# EasyEDA Pro project 14届国（未完成）.epro

# Schematic SCH

## Sheets
1 POWER: Create Date: 2024-05-15; Page Name: POWER; Project Name: lq14; Schematic Name: SCH; Update Date: 2024-05-15
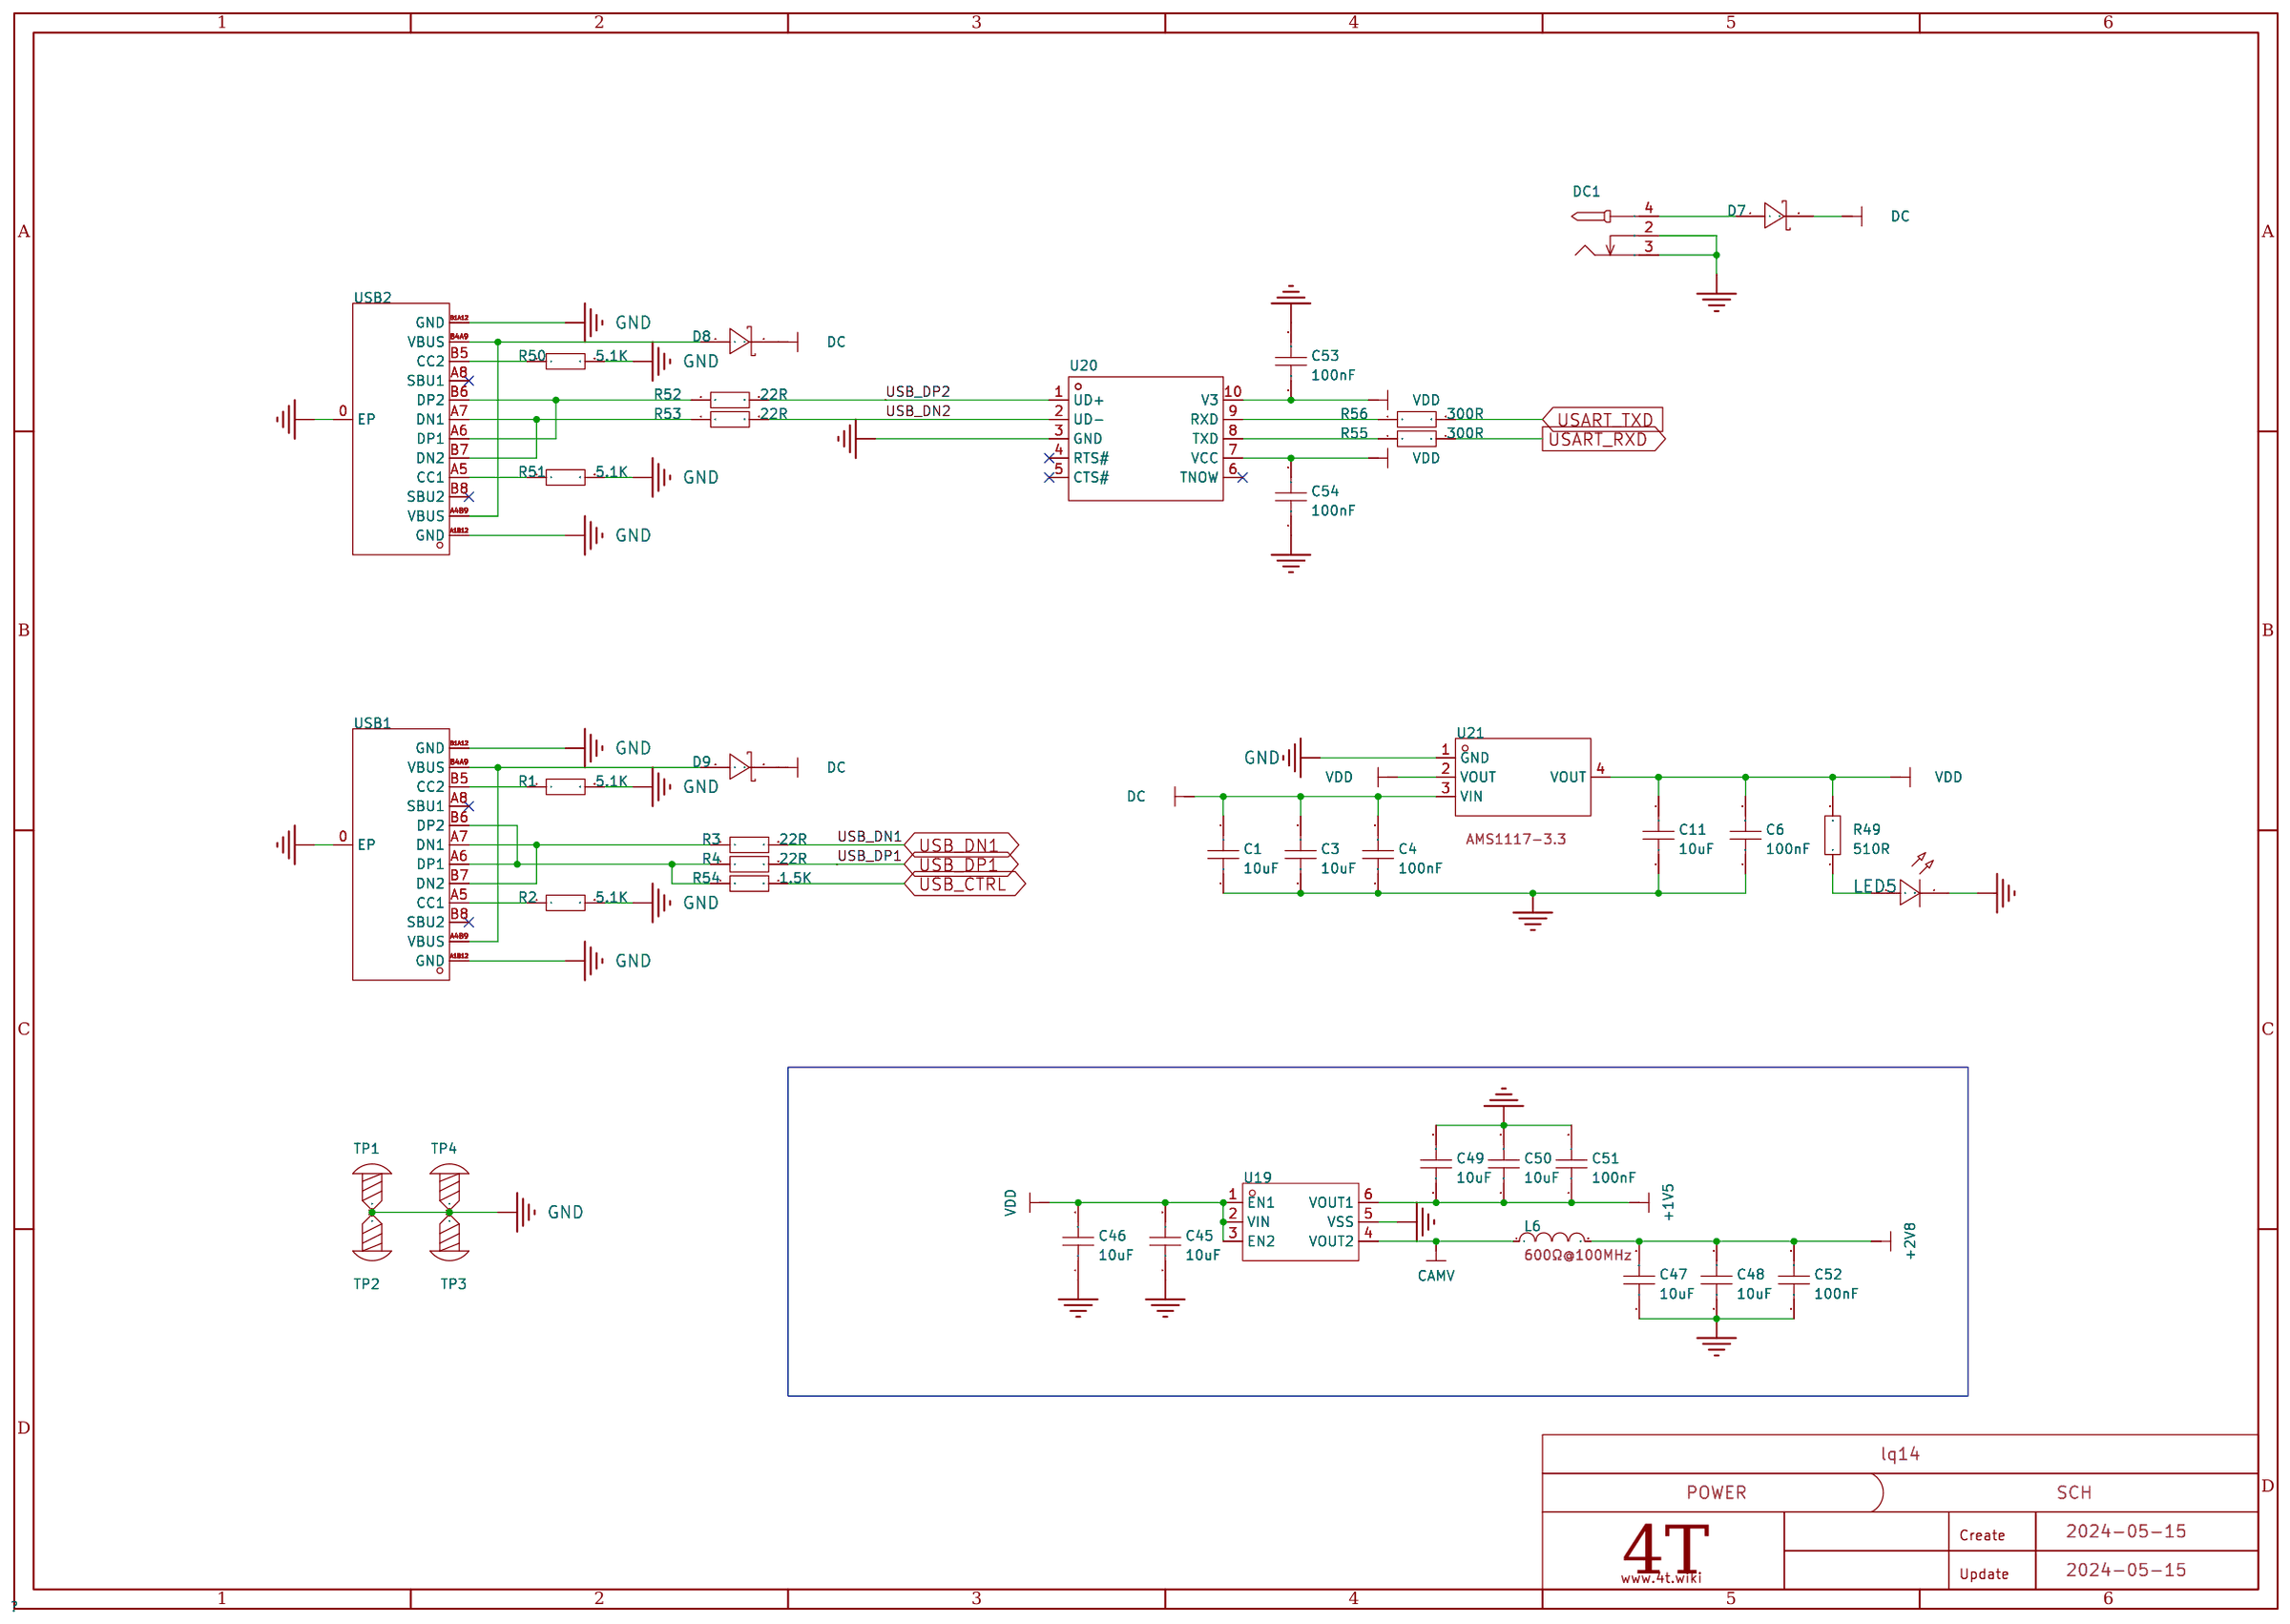
[diagram p0: POWER]
2 RELAY: Page Name: RELAY
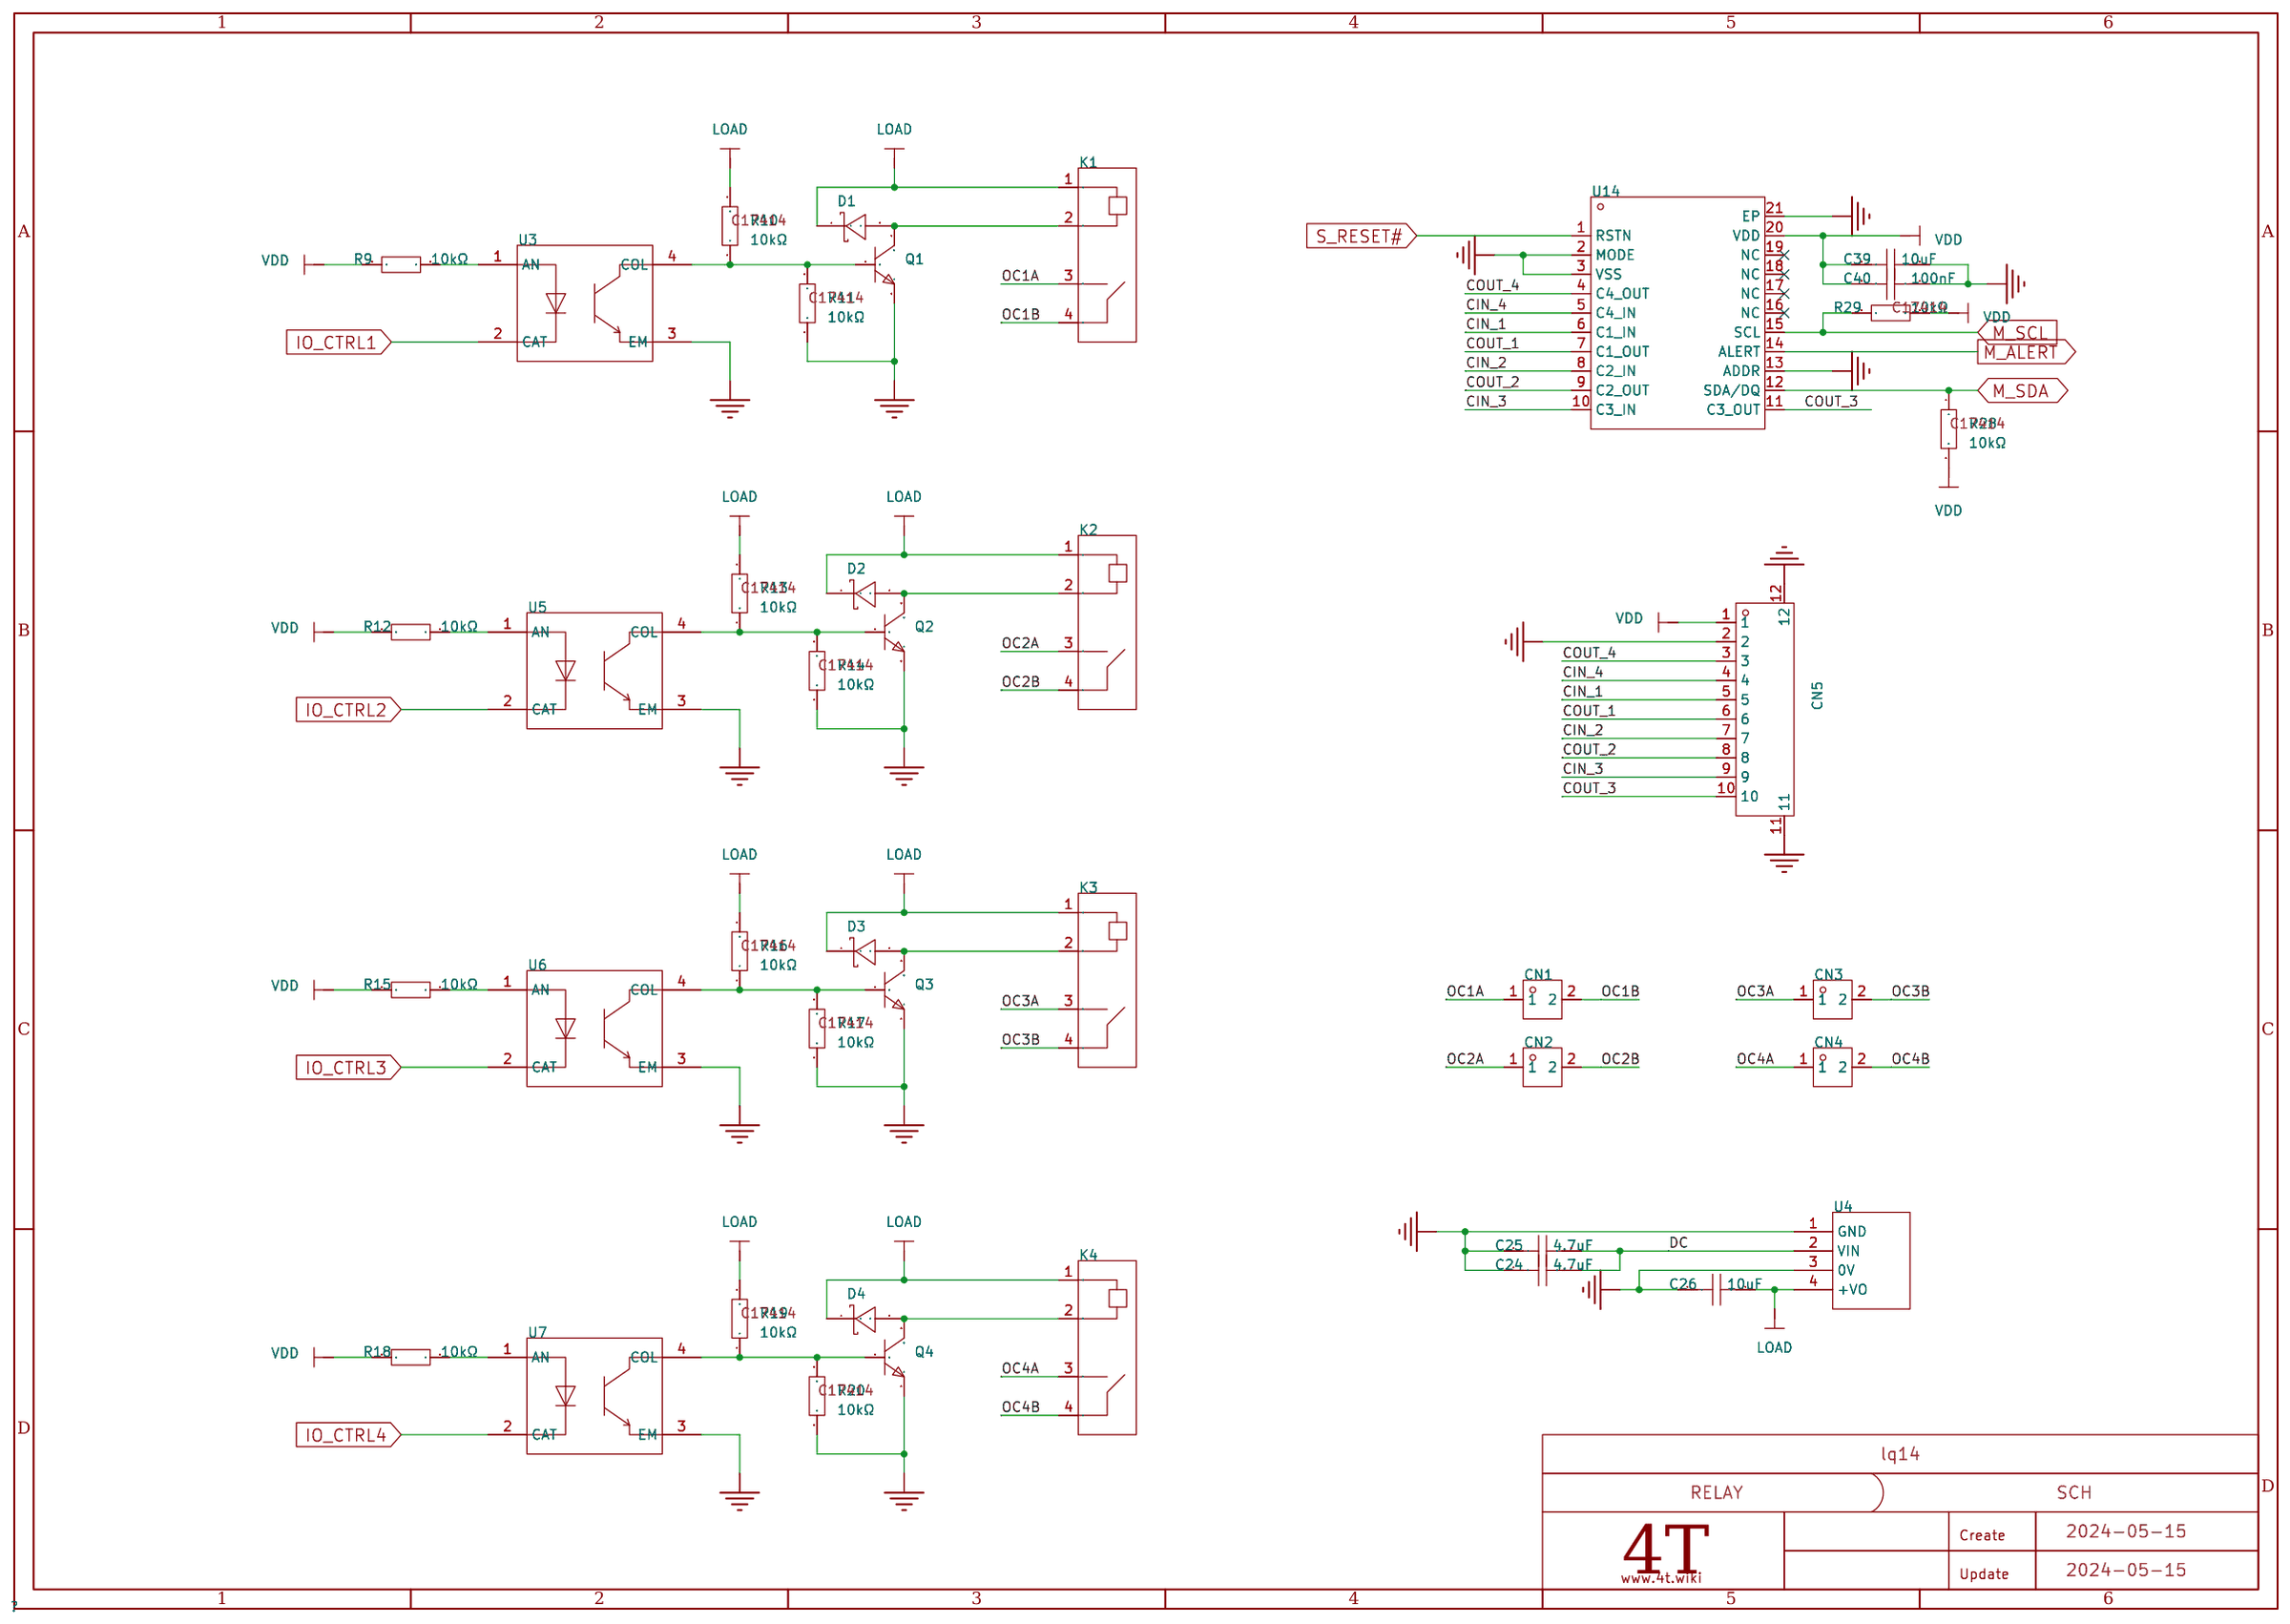
[diagram p1: RELAY]
3 MCU: Page Name: MCU
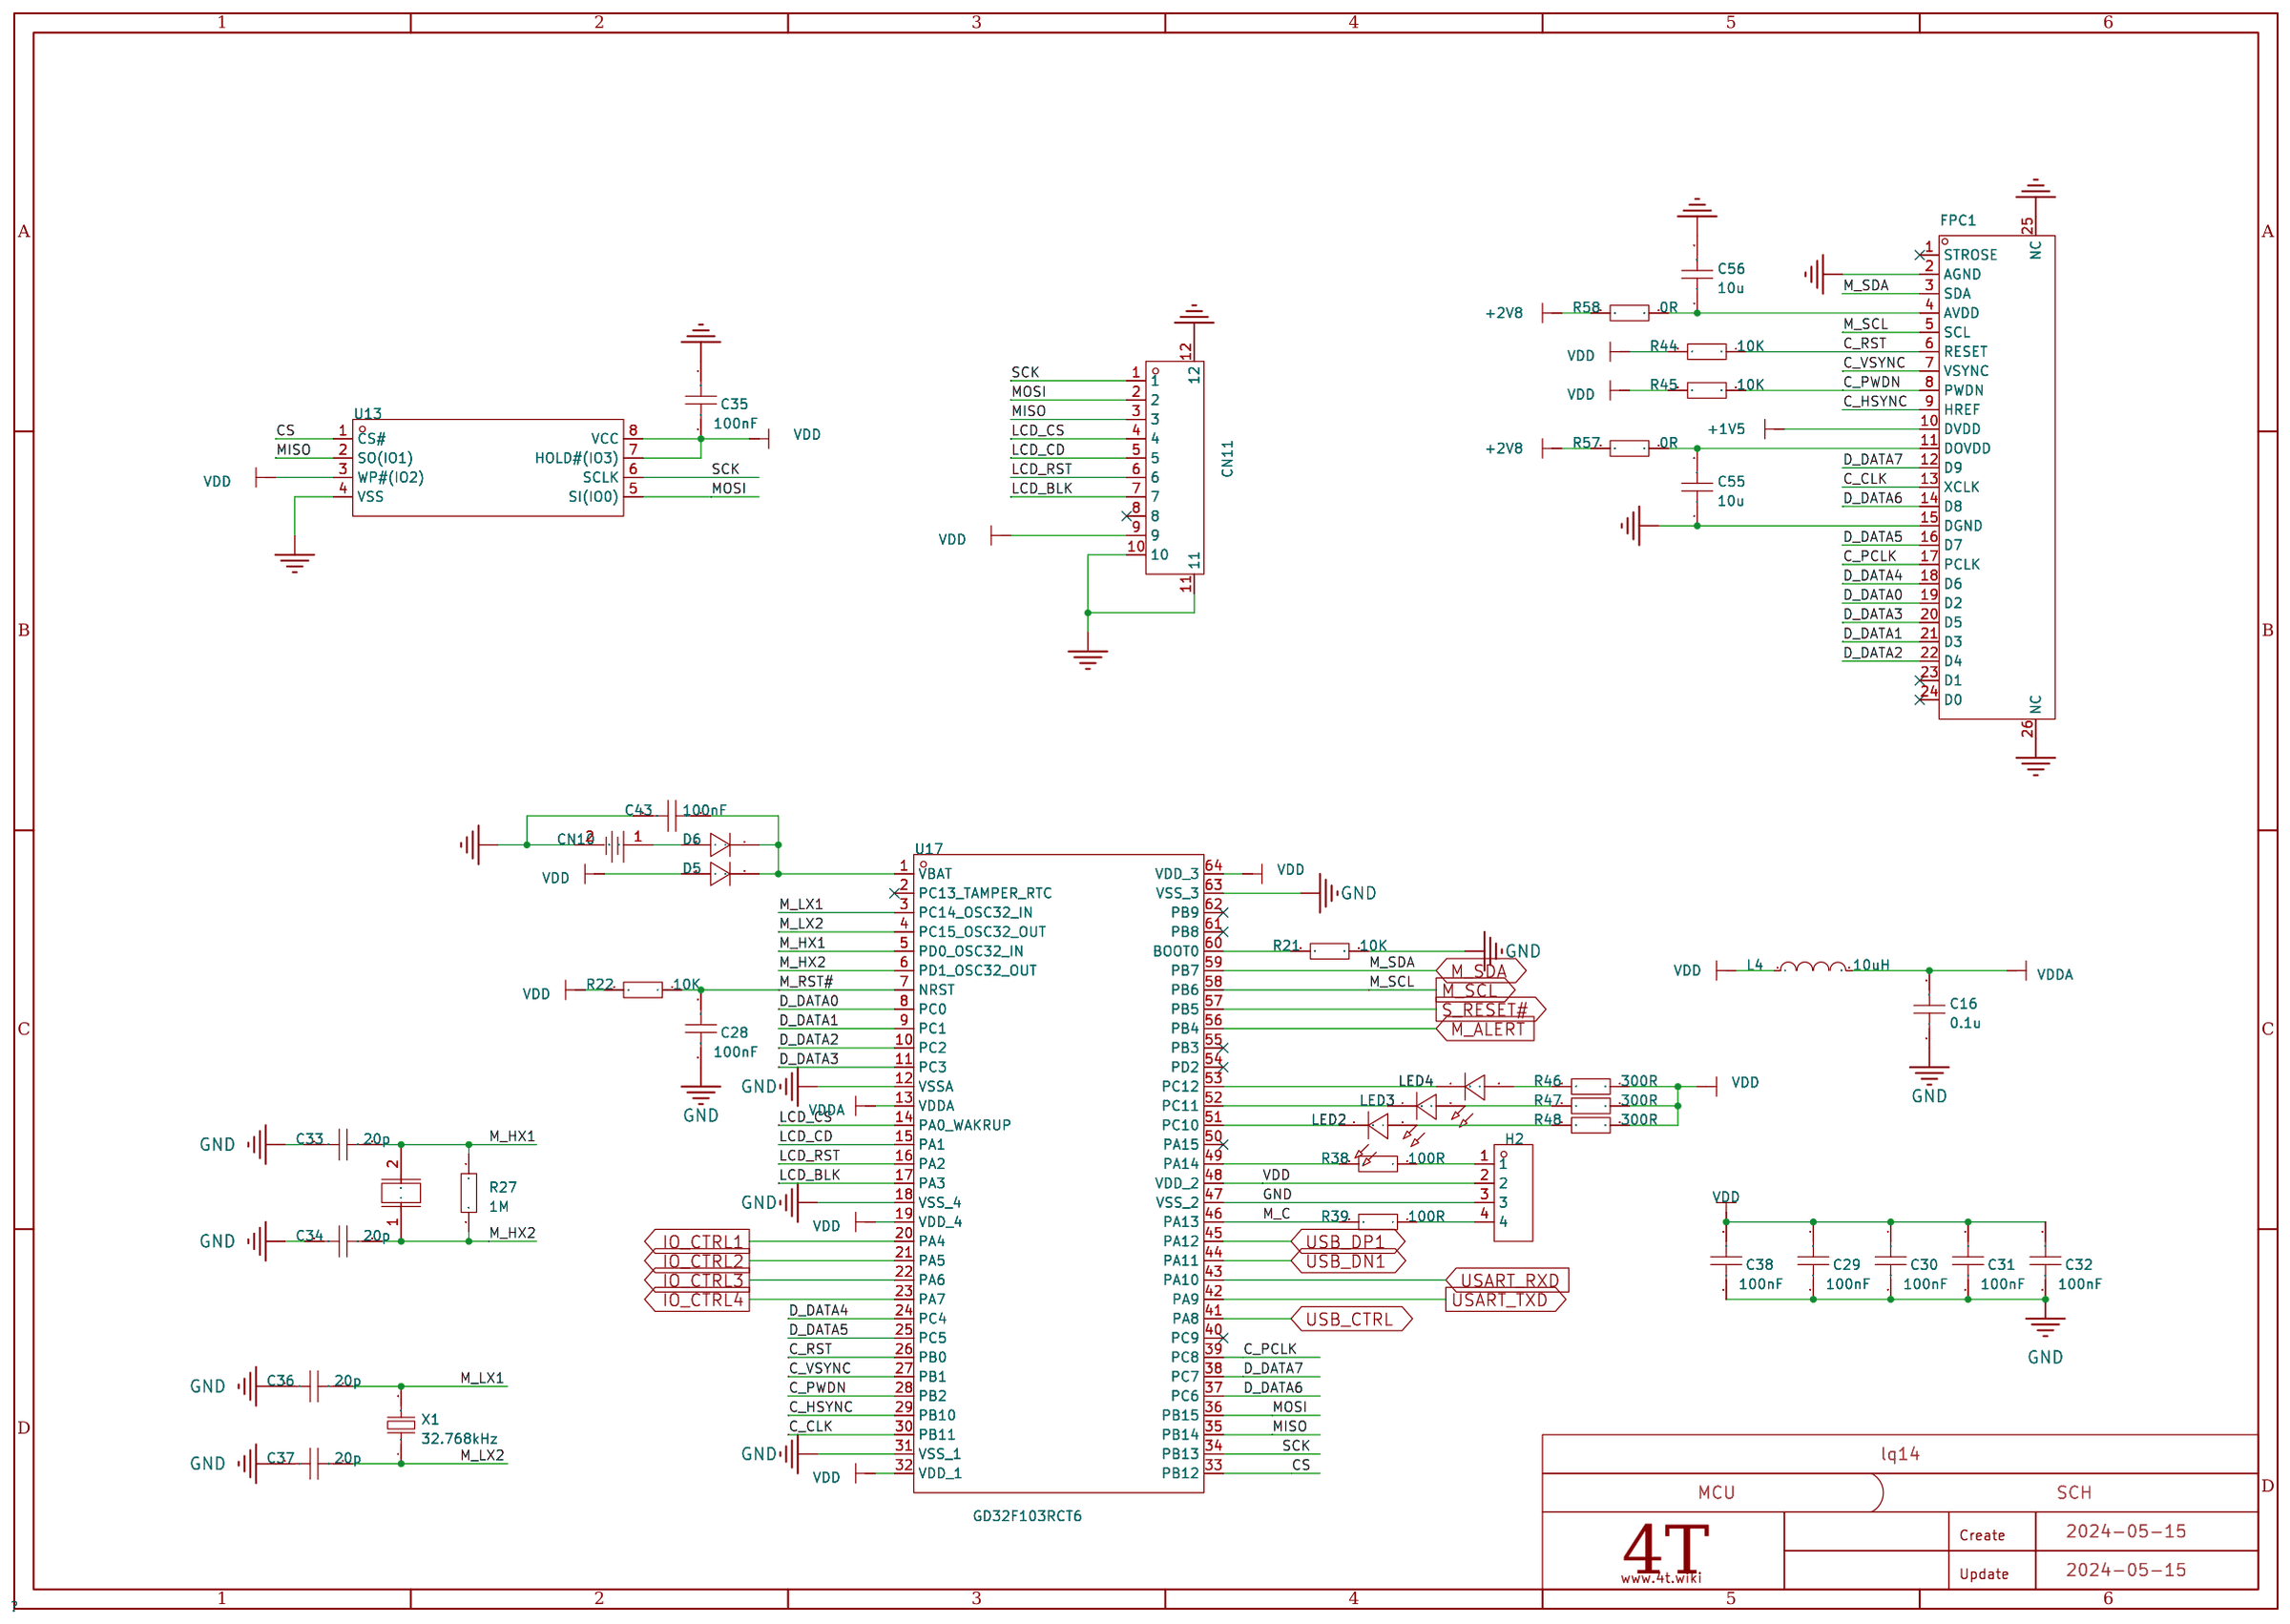
[diagram p2: MCU]

## Parts
sheet MCU
C16  0.1u  [C0805]
C28  100nF  [C0805]
C29  100nF  [C0805]
C30  100nF  [C0805]
C31  100nF  [C0805]
C32  100nF  [C0805]
C33  20p  [C0805]
C34  20p  [C0805]
C35  100nF  [C0805]
C36  20p  [C0805]
C37  20p  [C0805]
C38  100nF  [C0805]
C43  100nF  [C0805]
C55  10u  [C0805]
C56  10u  [C0805]
CN10  CR1220_B  [BAT-SMD_CR1220-2ZX]
CN11  KH-A1251WF-10A  [CONN_SMD_10P-P1.25_KINGHELM_KH-A1251WF-10A]
D5  1N4148WS  [SOD-323_L1.8-W1.3-LS2.5-RD]
D6  1N4148WS  [SOD-323_L1.8-W1.3-LS2.5-RD]
FPC1  F-FPC0M24P-C310  [FPC-SMD_P0.50-24P_XJ-FGS]
H2  2.54-1*4P母  [HDR-TH_4P-P2.54-V-F]
L4  10uH  [L0805]
LED2  -  [LED_0805]
LED3  -  [LED_0805]
LED4  -  [LED_0805]
R21  10K  [R0805]
R22  10K  [R0805]
R27  1M  [R0805]
R38  100R  [R0805]
R39  100R  [R0805]
R44  10K  [R0805]
R45  10K  [R0805]
R46  300R  [R0805]
R47  300R  [R0805]
R48  300R  [R0805]
R57  0R  [R0805]
R58  0R  [R0805]
U12  8M-5032-2P  [CRYSTAL-SMD_L5.0-W3.2]
U13  GD25Q16CSAG-SOP8_208MIL  [SOP-8_L5.2-W5.3-P1.27-LS7.9-BL]
U17  GD32F103RCT6  [LQFP-64_L10.0-W10.0-P0.50-LS12.0-BL]
X1  32.768kHz  [FC-135R_L3.2-W1.5]
sheet POWER
C1  10uF  [C0805]
C3  10uF  [C0805]
C4  100nF  [C0805]
C6  100nF  [C0805]
C11  10uF  [C0805]
C45  10uF  [C0805]
C46  10uF  [C0805]
C47  10uF  [C0805]
C48  10uF  [C0805]
C49  10uF  [C0805]
C50  10uF  [C0805]
C51  100nF  [C0805]
C52  100nF  [C0805]
C53  100nF  [C0805]
C54  100nF  [C0805]
D7  SS34  [SMA_L4.3-W2.6-LS5.0-RD]
D8  SS34  [SMA_L4.3-W2.6-LS5.0-RD]
D9  SS34  [SMA_L4.3-W2.6-LS5.0-RD]
DC1  -  [DC-2.0]
L6  BLM18AG601SN1D  [L0603]
LED5  -  [LED_0805]
R1  5.1K  [R0805]
R2  5.1K  [R0805]
R3  22R  [R0805]
R4  22R  [R0805]
R49  510R  [R0805]
R50  5.1K  [R0805]
R51  5.1K  [R0805]
R52  22R  [R0805]
R53  22R  [R0805]
R54  1.5K  [R0805]
R55  300R  [R0805]
R56  300R  [R0805]
TP1  -  [M3螺丝]
TP2  -  [M3螺丝]
TP3  -  [M3螺丝]
TP4  -  [M3螺丝]
U19  -  [SOT_DPV]
U20  CH340E  [MSOP-10_L3.0-W3.0-P0.50-LS5.0-BL]
U21  AMS1117-3.3  [SOT-223-3_L6.5-W3.4-P2.30-LS7.0-BR]
USB1  CQ-USB- TYPE-C 16P母座四脚插板有柱  [USB-C-SMD_CQ-USB-TYPE-C]
USB2  CQ-USB- TYPE-C 16P母座四脚插板有柱  [USB-C-SMD_CQ-USB-TYPE-C]
sheet RELAY
C24  4.7uF  [C0805]
C25  4.7uF  [C0805]
C26  10uF  [C0805]
C39  10uF  [C0805]
C40  100nF  [C0805]
CN1  KF128L-5.08-2P 蓝色  [TH_KF128L-5.08-2P]
CN2  KF128L-5.08-2P 蓝色  [TH_KF128L-5.08-2P]
CN3  KF128L-5.08-2P 蓝色  [TH_KF128L-5.08-2P]
CN4  KF128L-5.08-2P 蓝色  [TH_KF128L-5.08-2P]
CN5  KH-A1251WF-10A  [CONN_SMD_10P-P1.25_KINGHELM_KH-A1251WF-10A]
D1  SS14  [SMA_L4.2-W2.6-LS5.3-RD]
D2  SS14  [SMA_L4.2-W2.6-LS5.3-RD]
D3  SS14  [SMA_L4.2-W2.6-LS5.3-RD]
D4  SS14  [SMA_L4.2-W2.6-LS5.3-RD]
K1  HF49FD/012-1H12  [RELAY-TH_HF49FD-XXX-1H12-XXX]
K2  HF49FD/012-1H12  [RELAY-TH_HF49FD-XXX-1H12-XXX]
K3  HF49FD/012-1H12  [RELAY-TH_HF49FD-XXX-1H12-XXX]
K4  HF49FD/012-1H12  [RELAY-TH_HF49FD-XXX-1H12-XXX]
Q1  SS8050  [SOT-23-3_L2.9-W1.3-P1.90-LS2.4-BR]
Q2  SS8050  [SOT-23-3_L2.9-W1.3-P1.90-LS2.4-BR]
Q3  SS8050  [SOT-23-3_L2.9-W1.3-P1.90-LS2.4-BR]
Q4  SS8050  [SOT-23-3_L2.9-W1.3-P1.90-LS2.4-BR]
R9  10kΩ  [R0805]
R10  10kΩ  [R0805]
R11  10kΩ  [R0805]
R12  10kΩ  [R0805]
R13  10kΩ  [R0805]
R14  10kΩ  [R0805]
R15  10kΩ  [R0805]
R16  10kΩ  [R0805]
R17  10kΩ  [R0805]
R18  10kΩ  [R0805]
R19  10kΩ  [R0805]
R20  10kΩ  [R0805]
R28  10kΩ  [R0805]
R29  10kΩ  [R0805]
U3  TLP521-1XSM  [SMD-4_L4.6-W6.5-P2.54-LS10.2-BL]
U4  B0505S-1WR3  [PWRM-TH_B0503S-1WR3]
U5  TLP521-1XSM  [SMD-4_L4.6-W6.5-P2.54-LS10.2-BL]
U6  TLP521-1XSM  [SMD-4_L4.6-W6.5-P2.54-LS10.2-BL]
U7  TLP521-1XSM  [SMD-4_L4.6-W6.5-P2.54-LS10.2-BL]
U14  MDC04  [QFN-20_L3.0-W3.0-P0.40-BL-EP1.7]

## Library data of the parts
C1 C3 C4 C6 C11 C16 C45-C56 = CAP_0805: 容值:100nF;精度:±10%;额定电压:50V;温度系数:X7R;; Supplier Footprint: 0805
C28-C38 C43 = CAP_0603: Supplier Footprint: 0603
CN10 = CR1220_B: Supplier Part: C9900012049; Supplier Footprint: 1220; JLCPCB Part Class: 扩展库; Datasheet: https://atta.szlcsc.comnull; Supplier: LCSC
CN5 CN11 = KH-A1251WF-10A: 板载连接器MX1.25针座-10P 卧贴编带，匹配KH-A1250H-10P-JK; LCSC Part Name: 板载连接器; Supplier Part: C4943304; Manufacturer: kinghelm(金航标); Supplier Footprint: SMD,P=1.25mm; JLCPCB Part Class: Extended Part; Datasheet: https://atta.szlcsc.com/upload/public/pdf/source/20220712/B394C9B5DF1E4B9762CA63DDD21DD1B3.pdf; Supplier: LCSC
D5 D6 = 1N4148WS_C2128: 二极管配置:独立式;功率:200mW;直流反向耐压(Vr):100V;平均整流电流(Io):150mA;正向压降(Vf):1.25V@150mA;反向电流(Ir):1uA@75V;反向恢复时间(trr):4ns;工作温度:+150℃@(Tj);; LCSC Part Name: 100V 150mA 4ns T4; Supplier Part: C2128; Manufacturer: CJ(江苏长电/长晶); Supplier Footprint: SOD-323; JLCPCB Part Class: 基础库; Datasheet: https://atta.szlcsc.com/upload/public/pdf/source/20140809/1457707208178.pdf; Supplier: LCSC; Diode Configuration: 独立式; Power Dissipation: 200mW; Reverse Voltage (Vr): 100V; Average Rectified Current (Io): 150mA; Forward Voltage (Vf@If): 1.25V@150mA; Reverse Leakage Current: 1uA@75V; Reverse Recovery Time (trr): 4ns; Operating Temperature: +150℃@(Tj)
FPC1 = F-FPC0M24P-C310: 间距:0.5mm;触点数量:24;锁定特性:翻盖式;安装类型:卧贴;触点类型:下接;; LCSC Part Name: FPC插座 0.5mm间距 24P 翻盖式 下接; Supplier Part: C132514; Manufacturer: Ckmtw(灿科盟); Supplier Footprint: SMD,P=0.5mm; JLCPCB Part Class: Extended Part; Datasheet: https://atta.szlcsc.com/upload/public/pdf/source/20180105/C132514_15151572869031234524.pdf; Supplier: LCSC; Pitch: 0.5mm; Number of Contacts: 24; Locking Feature: 翻盖式; Mounting Type: 卧贴; Contact Type: 下接; Height Above Board: 2mm; FFC, FCB Thickness: 0.3mm~0.3mm; Pin Type: IN
H2 = 2.54-1*4P母: 排数:单排;总孔位数:4;间距:2.54mm;插孔结构:1x4P;行距:-;安装类型:直插;圆孔/方孔:方孔;额定电流:3A;额定电压:-;插孔方向:顶部;塑高:-;触头材质:青铜;触头镀层:-;工作温度范围:-40℃~+105℃;焊接温度(最大值):-;; LCSC Part Name: 2.54mm 1x4P; Supplier Part: C2718488; Manufacturer: BOOMELE(博穆精密); Supplier Footprint: 插件,P=2.54mm; JLCPCB Part Class: Extended Part; Datasheet: https://atta.szlcsc.com/upload/public/pdf/source/20210301/C2718488_F4427B881E42CAA8DDB0B1C12B3A522C.pdf; Supplier: LCSC; Number of Rows: 单排; Number of Holes: 4; Pitch: 2.54mm; Holes Structure: 1x4P; Mounting Type: 直插; Circular Hole / Square Hole: 方孔; Current Rating (Max): 3A; Holes Direction: 顶部; Contact Material: 青铜; Operating Temperature Range: -40℃~+105℃
L4 = L_0805: 电感值:10uH;精度:±10%;额定电流:15mA;饱和电流(Isat):-;直流电阻(DCR):1.15Ω;
LED2-LED4 = LED_0805-G: Supplier Footprint: 0805
R1-R4 R21 R22 R27 R38 R39 R44-R58 = Res_0805: Supplier Footprint: 0805
U12 = 8M-5032-2P: Supplier Part: C9900017580; Supplier Footprint: 8MHz; JLCPCB Part Class: 扩展库; Supplier: LCSC
U13 = GD25Q16CSAG-SOP8_208MIL: Supplier Part: C2891506; Supplier Footprint: SOP-8_L4.9-W3.9-P1.27-LS7.9; JLCPCB Part Class: 扩展库; Supplier: LCSC
U17 = GD32F103RCT6: CPU内核:ARM Cortex-M3;CPU最大主频:108MHz;程序存储容量:256KB;程序存储器类型:FLASH;RAM总容量:48KB;GPIO端口数量:51;; LCSC Part Name: ARM Cortex-M3 108MHz; Supplier Part: C80687; Manufacturer: GigaDevice(兆易创新); Supplier Footprint: LQFP-64(10x10); JLCPCB Part Class: 扩展库; Datasheet: https://atta.szlcsc.com/upload/public/pdf/source/20160910/1473490292110.pdf; Supplier: LCSC; CPU Core: ARM Cortex-M3; CPU Maximum Speed: 108MHz; Operating Voltage Range: 2.6V~3.6V; Program Storage Size: 256KB; Program Memory Type: FLASH; RAM Size: 48KB; EEPROM: 256KB; GPIO Ports Number: 51; ADC (Bit): 12bit; DAC (Bit): 12bit; PWM (Bit): 16bit; 16Bit Timer: 6; CAN: 1; UART/USART: 5; I2C: 2; SPI: 3; Universal Serial Bus: 有; Peripheral/Function: 片载温度传感器；DMA；看门狗；LIN总线协议；PWM；IrDA；SDIO；RTC实时时钟; Watchdog: 有; Real-Time Clock: 有; Infrared Data Association: 有; Secure Digital Input and Output: 有; Direct Memory Access: 有; Internal Oscillator: 有; Operating Temperature Range: -40℃~+85℃
X1 = Q13FC1350000400: 频率:32.768kHz;频率公差:±20ppm;负载电容:12.5pF;; LCSC Part Name: 32.768kHz ±20ppm 12.5pF; Supplier Part: C32346; Manufacturer: EPSON(爱普生); Supplier Footprint: SMD3215-2P; JLCPCB Part Class: 基础库; Datasheet: https://atta.szlcsc.com/upload/public/pdf/source/20190108/C32346_746D6B07EAF90824457A96480007685F.pdf; Supplier: LCSC; Crystal Type: 贴片无源晶振; Frequency Tolerance: ±20ppm; Load Capacitance: 12.5pF; Equivalent Series Resistance (ESR): 70kΩ; Operating Temperature: -40℃~+85℃
D7-D9 = SS34: Supplier Part: C9900023345; Supplier Footprint: SMA,DO-214AC; JLCPCB Part Class: 扩展库; Datasheet: 2022-07-04/534833A/5ff3008f79ea4c6ab22b1f3463cee262/20210714020425519.pdf; Supplier: LCSC
DC1 = DC-005_2.0: Supplier Footprint: 插件
L6 = BLM18AG601SN1D: 标称阻抗@测试频率:600Ω@100MHz;误差:±25%;直流电阻(RDC):380mΩ;额定电流:500mA;电路数:1;; LCSC Part Name: 600Ω@100MHz ±25%; Supplier Part: C19330; Manufacturer: muRata(村田); Supplier Footprint: 0603; JLCPCB Part Class: 扩展库; Datasheet: https://atta.szlcsc.com/upload/public/pdf/source/20180326/C19330_93F4AC33FF94C8E22511353688ADC0FA.pdf; Supplier: LCSC; Impedance @ Frequency: 600Ω@100MHz; Tolerance: ±25%; DC Resistance: 380mΩ; Current Rating: 500mA; Circuits: 1
LED5 = LED_0805-R: Supplier Footprint: 0805
TP1-TP4 = M3螺丝: Supplier Footprint: 插件
U19 = DPV
U20 = CH340E: 应用功能:收发器;接口协议:USB 2.0;数据速率:2Mbps;; LCSC Part Name: USB转串口芯片 CH340; Supplier Part: C99652; Manufacturer: WCH(南京沁恒); Supplier Footprint: MSOP-10; JLCPCB Part Class: 扩展库; Datasheet: https://atta.szlcsc.com/upload/public/pdf/source/20200819/C99652_97FFC0DF2539BFF05CD752AD9221D632.pdf; Supplier: LCSC; Applications Function: 收发器; Protocol: USB 2.0; Data Rate: 2Mbps; Supply Voltage: 3.3V；5V
U21 = AMS1117-3.3_C6186: 输出类型:固定;输出极性:正;最大输入电压:-;输出电压:3.3V;输出电流:1A;电源纹波抑制比(PSRR):72dB@(120Hz);; LCSC Part Name: 输出3.3V 1A; Supplier Part: C6186; Manufacturer: AMS; Supplier Footprint: SOT-223; JLCPCB Part Class: 基础库; Datasheet: https://atta.szlcsc.com/upload/public/pdf/source/20180727/C6186_7A095716F0823C02F1997A905E26C086.pdf; Supplier: LCSC; Output Type: 固定; Output Polarity: 正; Number of Outputs: 1; Output Voltage: 3.3V; Dropout Voltage: 1.3V@(800mA); Output Current: 1A; Power Supply Rejection Ratio (PSRR): 72dB@(120Hz)
USB1 USB2 = CQ-USB- TYPE-C 16P母座四脚插板有柱: Supplier Part: C9900026759; Supplier Footprint: USB-TYPE-C-SMD-16P; JLCPCB Part Class: 扩展库; Datasheet: https://atta.szlcsc.comnull; Supplier: LCSC
C24-C26 C39 C40 = CAP_0805: Supplier Footprint: 0805
CN1-CN4 = KF128L-5.08-2P 蓝色: Supplier Part: C2916931; Supplier Footprint: 5.08-2P; JLCPCB Part Class: 扩展库; Supplier: LCSC
D1-D4 = SS14_C2480: 二极管配置:独立式;直流反向耐压(Vr):40V;平均整流电流(Io):1A;正向压降(Vf):550mV@1A;反向电流(Ir):500uA@40V;; LCSC Part Name: 40V 1A 550mV@1A 框架工艺; Supplier Part: C2480; Manufacturer: MDD; Supplier Footprint: SMA(DO-214AC); JLCPCB Part Class: 基础库; Datasheet: https://atta.szlcsc.com/upload/public/pdf/source/20230314/CB2C302F91CEFB8A73D1DF7B261C7D58.pdf; Supplier: LCSC; Diode Configuration: 独立式; Reverse Voltage (Vr): 40V; Average Rectified Current (Io): 1A; Forward Voltage (Vf@If): 550mV@1A; Reverse Leakage Current (Ir): 500uA@40V
K1-K4 = HF49FD/012-1H12: 线圈电压:12V;线圈类型:非极化-单线圈;触点形式:一组常开:1A(单刀单掷-常开);最大切换电流:5A;触点材料:AgNi;; LCSC Part Name: 宏发继电器; Supplier Part: C399491; Manufacturer: HF(宏发); Supplier Footprint: SIP-4; JLCPCB Part Class: 扩展库; Datasheet: https://atta.szlcsc.com/upload/public/pdf/source/20190620/C399491_B2190B02DDD565265172868420E7880D.pdf; Supplier: LCSC; Coil Voltage: 12V; Coil Type: 非极化-单线圈; Pin Number: 4; Contact Form: 一组常开:1A(单刀单掷-常开); Maximum Switching Current: 5A; Maximum Switching Voltage: 250V@AC；30V@DC; Coil Rated Power: 120mW; Contact Rating: 5A@30VDC；5A@250VAC; Coil Resistance: 1.2kΩ; Operate Time: 10ms; Release Time: 5ms; Contact Resistance: 100mΩ; Contact Material: AgNi; Operating Temperature: -40℃~+85℃
Q1-Q4 = SS8050_C2150: 晶体管类型:NPN;集射极击穿电压(Vceo):25V;集电极电流(Ic):1.5A;功率(Pd):300mW;直流电流增益(hFE@Ic,Vce):200@100mA,1V;; LCSC Part Name: NPN 25V 1.5A Y1 200-350; Supplier Part: C2150; Manufacturer: CJ(江苏长电/长晶); Supplier Footprint: SOT-23; JLCPCB Part Class: 基础库; Datasheet: https://atta.szlcsc.com/upload/public/pdf/source/20230322/AEE86F4B043774EFF80CAEA14A37D9E9.pdf; Supplier: LCSC; Transistor Type: NPN; Collector-Emitter Breakdown Voltage (Vceo): 25V; Collector Current (Ic): 1.5A; Power Dissipation (Pd): 300mW; Collector Cut-Off Current (Icbo): 100nA; Collector-Emitter Saturation Voltage (VCE(sat)@Ic,Ib): 500mV@800mA,80mA; DC Current Gain (hFE@Ic,Vce): 200@100mA,1V; Transition Frequency (fT): 100MHz; Operating Temperature: +150℃@(Tj)
R9-R20 R28 R29 = 0805W8F1002T5E_C17414: 电阻类型:厚膜电阻;阻值:10kΩ;精度:±1%;功率:125mW;; LCSC Part Name: 10kΩ ±1% 125mW; Supplier Part: C17414; Manufacturer: UNI-ROYAL(厚声); Manufacturer Part: 0805W8F1002T5E; Supplier Footprint: 0805; JLCPCB Part Class: Basic Part; Datasheet: https://atta.szlcsc.com/upload/public/pdf/source/20200306/C422600_1E6D84923E4A46A82E41ADD87F860B5C.pdf; Supplier: LCSC; Type: 厚膜电阻; Tolerance: ±1%; Power(Watts): 125mW; Temperature Coefficient: ±100ppm/℃; Overload Voltage (Max): 150V; Operating Temperature Range: -55℃~+155℃
U3 U5-U7 = TLP521-1XSM: 输入电压类型:DC;输出通道数:1;正向电压:1.15V;反向电压:6V;输出电流:50mA;接收端电压:55V;集射极饱和电压(Vce(sat)@Ic,IF):400mV@2.4mA,8mA;隔离电压(rms):5.3kV;; LCSC Part Name: DC输入 隔离电压(rms):5300V; Supplier Part: C83157; Manufacturer: ISOCOM(英国安数光); Supplier Footprint: SMD-4P; JLCPCB Part Class: 扩展库; Datasheet: https://atta.szlcsc.com/upload/public/pdf/source/20181205/C83157_755450129BF4CC137580CACDD5B9451F.pdf; Supplier: LCSC; Input voltage type: DC; Output Type: 光电三极管; Number of Outputs: 1; Forward Voltage: 1.15V; Reverse Voltage: 6V; Output Current: 50mA; Receiving End Voltage: 55V; Collector-Emitter Saturation Voltage (Vce(sat)@Ic,IF): 400mV@2.4mA,8mA; Rise time: 4us@2mA,100Ω; Fall time: 3us@2mA,100Ω; Isolation Voltage(rms): 5.3kV; Operating Temperature: -30℃~+100℃
U4 = B0505S-1WR3: 电压输出的组数:-;最大输入电压:-;输出电压:-;输出电流（最大值/满载）:-;; Supplier Part: C382179; Manufacturer: Taisko(台思科); Supplier Footprint: Through Hole; JLCPCB Part Class: 扩展库; Datasheet: https://atta.szlcsc.com/upload/public/pdf/source/20190730/C382179_FFA5879528856A2CD72435973011A927.pdf; Supplier: LCSC
U14 = MDC04: 测量范围 0 ~119pF 接口 I?C 测量速度 3 ~20ms 分辨率 0.1fF 供电电压    2.0V~5.5V 平均功耗 4.5μA 通道数 4; LCSC Part Name: I2C接口&单总线高精度数字电容传感器; Supplier Part: C2843541; Manufacturer: Mysentech(敏源传感); Supplier Footprint: QFN-20-EP(3x3); JLCPCB Part Class: 扩展库; Datasheet: https://atta.szlcsc.com/upload/public/pdf/source/20210825/654D83FD6FE4FC7E7E5C48FB3397AD56.pdf; Supplier: LCSC

## Nets
+1V5: C49.1 C50.1 C51.1 FPC1.10(DVDD) U19.6(VOUT1)
+2V8: C47.2 C48.2 C52.2 L6.2 R57.2 R58.2
GND: C1.1 C3.1 C4.1 C6.1 C11.1 C16.1 C24.1 C25.1 C28.2 C29.2 C30.2 C31.2 C32.2 C33.1 C34.1 C35.1 C36.1 C37.1 C38.2 C39.2 C40.1 C43.2 C45.1 C46.1 C47.1 C48.1 C49.2 C50.2 C51.2 C52.1 C53.2 C54.1 C55.1 C56.2 CN5.2 CN5.11 CN5.12 CN10.2 CN11.10 CN11.11 CN11.12 DC1.2 DC1.3 FPC1.2(AGND) FPC1.15(DGND) FPC1.25(NC) FPC1.26(NC) H2.3 LED5.1(C) R1.2 R2.2 R21.1 R50.2 R51.2 TP1.1 TP2.1 TP3.1 TP4.1 U4.1(GND) U13.4(VSS) U14.2(MODE) U14.3(VSS) U14.13(ADDR) U14.21(EP) U17.12(VSSA) U17.18(VSS_4) U17.31(VSS_1) U17.47(VSS_2) U17.63(VSS_3) U19.5(VSS) U20.3(GND) U21.1(GND) USB1.0(EP) USB1.A1B12(GND) USB1.B1A12(GND) USB2.0(EP) USB2.A1B12(GND) USB2.B1A12(GND)
VDD: C6.2 C11.2 C29.1 C30.1 C31.1 C32.1 C35.2 C38.1 C39.1 C40.2 C45.2 C46.2 C53.1 C54.2 CN5.1 CN11.9 D5.2(A) H2.2 L4.1 R9.1 R12.1 R15.1 R18.1 R22.2 R28.2 R29.1 R44.2 R45.2 R46.1 R47.1 R48.1 R49.2 U13.3(WP#(IO2)) U13.7(HOLD#(IO3)) U13.8(VCC) U14.20(VDD) U17.19(VDD_4) U17.32(VDD_1) U17.48(VDD_2) U17.64(VDD_3) U19.1(EN1) U19.2(VIN) U19.3(EN2) U20.7(VCC) U20.10(V3) U21.2(VOUT) U21.4(VOUT)
VDDA: C16.2 L4.2 U17.13(VDDA)
0: C26.2 Q1.2(E) Q2.2(E) Q3.2(E) Q4.2(E) R11.1 R14.1 R17.1 R20.1 U3.3(EM) U4.3(0V) U5.3(EM) U6.3(EM) U7.3(EM)
C_CLK: FPC1.13(XCLK) U17.30(PB11)
C_HSYNC: FPC1.9(HREF) U17.29(PB10)
C_PCLK: FPC1.17(PCLK) U17.39(PC8)
C_PWDN: FPC1.8(PWDN) R45.1 U17.28(PB2)
C_RST: FPC1.6(RESET) R44.1 U17.26(PB0)
C_VSYNC: FPC1.7(VSYNC) U17.27(PB1)
CAMV: L6.1 U19.4(VOUT2)
CIN_1: CN5.5 U14.6(C1_IN)
CIN_2: CN5.7 U14.8(C2_IN)
CIN_3: CN5.9 U14.10(C3_IN)
CIN_4: CN5.4 U14.5(C4_IN)
COUT_1: CN5.6 U14.7(C1_OUT)
COUT_2: CN5.8 U14.9(C2_OUT)
COUT_3: CN5.10 U14.11(C3_OUT)
COUT_4: CN5.3 U14.4(C4_OUT)
CS: U13.1(CS#) U17.33(PB12)
D_DATA0: FPC1.19(D2) U17.8(PC0)
D_DATA1: FPC1.21(D3) U17.9(PC1)
D_DATA2: FPC1.22(D4) U17.10(PC2)
D_DATA3: FPC1.20(D5) U17.11(PC3)
D_DATA4: FPC1.18(D6) U17.24(PC4)
D_DATA5: FPC1.16(D7) U17.25(PC5)
D_DATA6: FPC1.14(D8) U17.37(PC6)
D_DATA7: FPC1.12(D9) U17.38(PC7)
DC: C1.2 C3.2 C4.2 C24.2 C25.2 D7.1(K) D8.1(K) D9.1(K) U4.2(VIN) U21.3(VIN)
IO_CTRL1: U3.2(CAT) U17.20(PA4)
IO_CTRL2: U5.2(CAT) U17.21(PA5)
IO_CTRL3: U6.2(CAT) U17.22(PA6)
IO_CTRL4: U7.2(CAT) U17.23(PA7)
LCD_BLK: CN11.7 U17.17(PA3)
LCD_CD: CN11.5 U17.15(PA1)
LCD_CS: CN11.4 U17.14(PA0_WAKRUP)
LCD_RST: CN11.6 U17.16(PA2)
LOAD: C26.1 D1.1(K) D2.1(K) D3.1(K) D4.1(K) K1.1 K2.1 K3.1 K4.1 R10.2 R13.2 R16.2 R19.2 U4.4(+VO)
M_ALERT: U14.14(ALERT) U17.56(PB4)
M_C: R39.2 U17.46(PA13)
M_HX1: C33.2 R27.1 U12.2 U17.5(PD0_OSC32_IN)
M_HX2: C34.2 R27.2 U12.1 U17.6(PD1_OSC32_OUT)
M_LX1: C36.2 U17.3(PC14_OSC32_IN) X1.2
M_LX2: C37.2 U17.4(PC15_OSC32_OUT) X1.1
M_RST#: C28.1 R22.1 U17.7(NRST)
M_SCL: FPC1.5(SCL) R29.2 U14.15(SCL) U17.58(PB6)
M_SDA: FPC1.3(SDA) R28.1 U14.12(SDA/DQ) U17.59(PB7)
MISO: CN11.3 U13.2(SO(IO1)) U17.35(PB14)
MOSI: CN11.2 U13.5(SI(IO0)) U17.36(PB15)
OC1A: CN1.1 K1.3
OC1B: CN1.2 K1.4
OC2A: CN2.1 K2.3
OC2B: CN2.2 K2.4
OC3A: CN3.1 K3.3
OC3B: CN3.2 K3.4
OC4A: CN4.1 K4.3
OC4B: CN4.2 K4.4
S_RESET#: U14.1(RSTN) U17.57(PB5)
SCK: CN11.1 U13.6(SCLK) U17.34(PB13)
USART_RXD: R55.2 U17.43(PA10)
USART_TXD: R56.2 U17.42(PA9)
USB_CTRL: R54.2 U17.41(PA8)
USB_DN1: R3.2 U17.44(PA11)
USB_DN2: R53.2 U20.2(UD-)
USB_DP1: R4.2 U17.45(PA12)
USB_DP2: R52.2 U20.1(UD+)
$1N757: R1.1 USB1.B5(CC2)
$1N782: R2.1 USB1.A5(CC1)
$1N965: D9.2(A) USB1.A4B9(VBUS) USB1.B4A9(VBUS)
$1N986: R3.1 USB1.A7(DN1) USB1.B7(DN2)
$1N5837: LED5.2(A) R49.1
$1N6125: R51.1 USB2.A5(CC1)
$1N6128: R50.1 USB2.B5(CC2)
$1N6129: D8.2(A) USB2.A4B9(VBUS) USB2.B4A9(VBUS)
$1N6270: R52.1 USB2.A6(DP1) USB2.B6(DP2)
$1N6277: R53.1 USB2.A7(DN1) USB2.B7(DN2)
$1N6306: R4.1 R54.1 USB1.A6(DP1) USB1.B6(DP2)
$1N6538: R55.1 U20.8(TXD)
$1N6566: R56.1 U20.9(RXD)
$1N7582: D7.2(A) DC1.4
$2N490: R9.2 U3.1(AN)
$2N1169: Q1.1(B) R10.1 R11.2 U3.4(COL)
$2N1323: D1.2(A) K1.2 Q1.3(C)
$2N1681: R12.2 U5.1(AN)
$2N1686: Q2.1(B) R13.1 R14.2 U5.4(COL)
$2N1700: D2.2(A) K2.2 Q2.3(C)
$2N2005: R15.2 U6.1(AN)
$2N2010: Q3.1(B) R16.1 R17.2 U6.4(COL)
$2N2024: D3.2(A) K3.2 Q3.3(C)
$2N2329: R18.2 U7.1(AN)
$2N2334: Q4.1(B) R19.1 R20.2 U7.4(COL)
$2N2348: D4.2(A) K4.2 Q4.3(C)
$3N3779: CN10.1 D6.2(A)
$3N4170: H2.1 R38.1
$3N4171: H2.4 R39.1
$3N4361: R21.2 U17.60(BOOT0)
$3N4426: C43.1 D5.1(K) D6.1(K) U17.1(VBAT)
$3N5935: R38.2 U17.49(PA14)
$3N8528: LED2.1(C) U17.51(PC10)
$3N8530: LED3.1(C) U17.52(PC11)
$3N8532: LED4.1(C) U17.53(PC12)
$3N8599: LED4.2(A) R46.2
$3N8602: LED3.2(A) R47.2
$3N8605: LED2.2(A) R48.2
$3N13768: C55.2 FPC1.11(DOVDD) R57.1
$3N13829: C56.1 FPC1.4(AVDD) R58.1

Not connected (* = marked no-connect by the designer): CN11 8*; FPC1 1(STROSE)* 23(D1)* 24(D0)*; U14 16(NC)* 17(NC)* 18(NC)* 19(NC)*; U17 2(PC13_TAMPER_RTC)* 40(PC9)* 50(PA15)* 54(PD2)* 55(PB3)* 61(PB8)* 62(PB9)*; U20 4(RTS#)* 5(CTS#)* 6(TNOW)*; USB1 A8(SBU1)* B8(SBU2)*; USB2 A8(SBU1)* B8(SBU2)*

# Board PCB
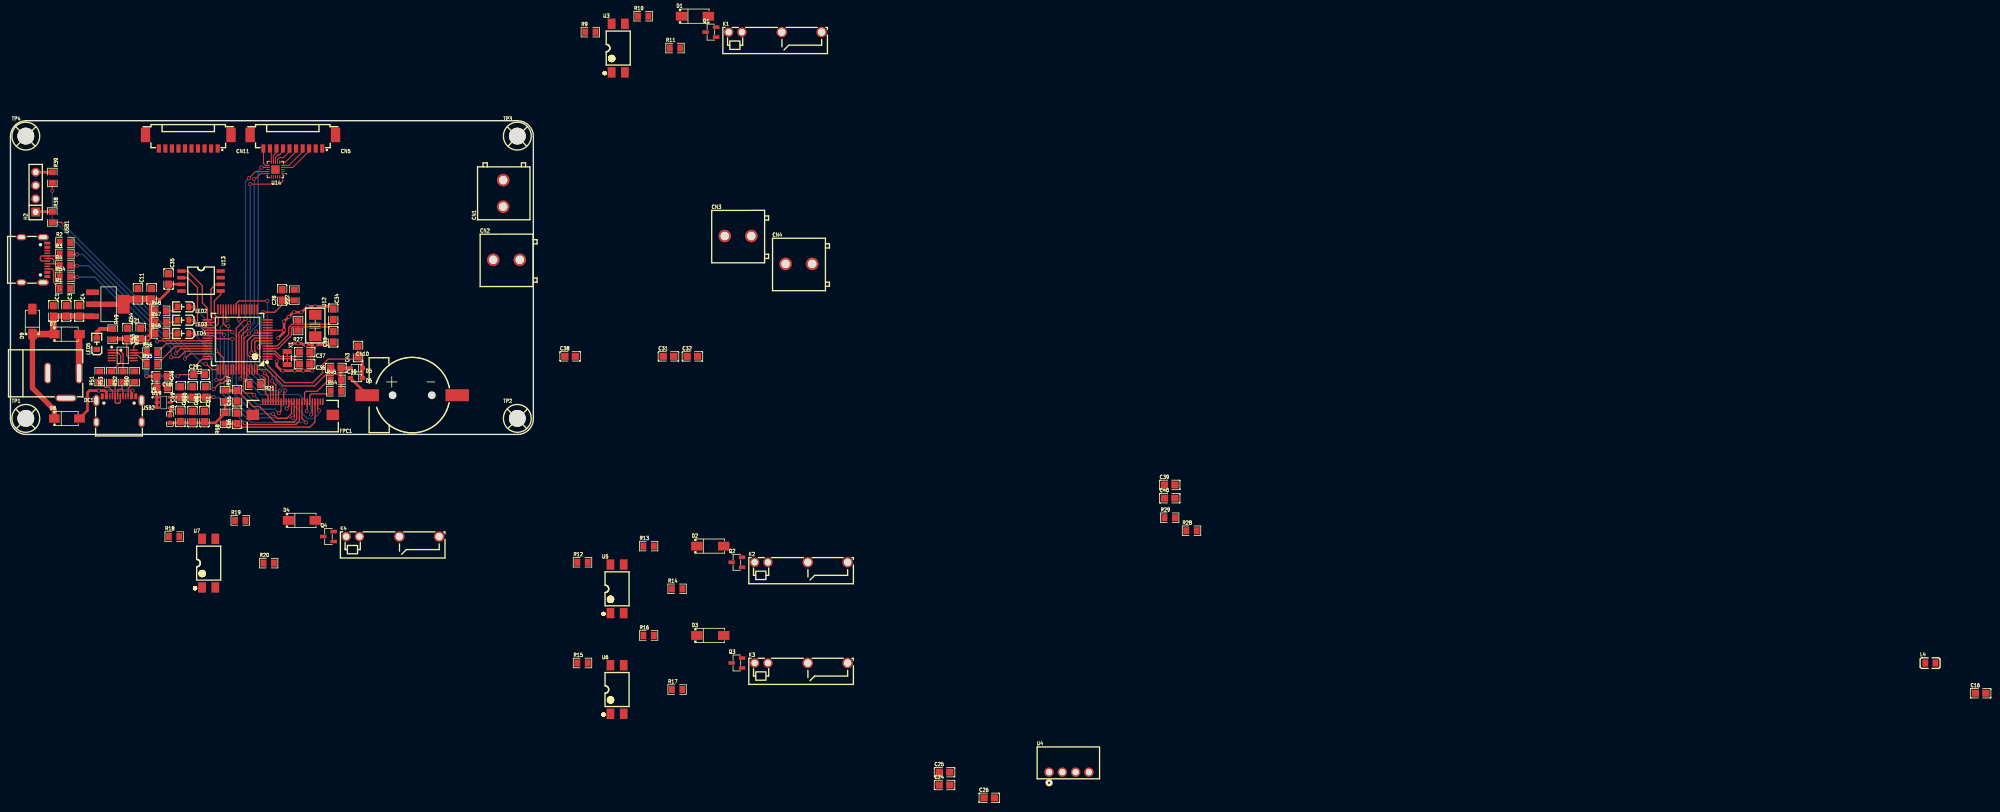
[diagram p3: board, top side]
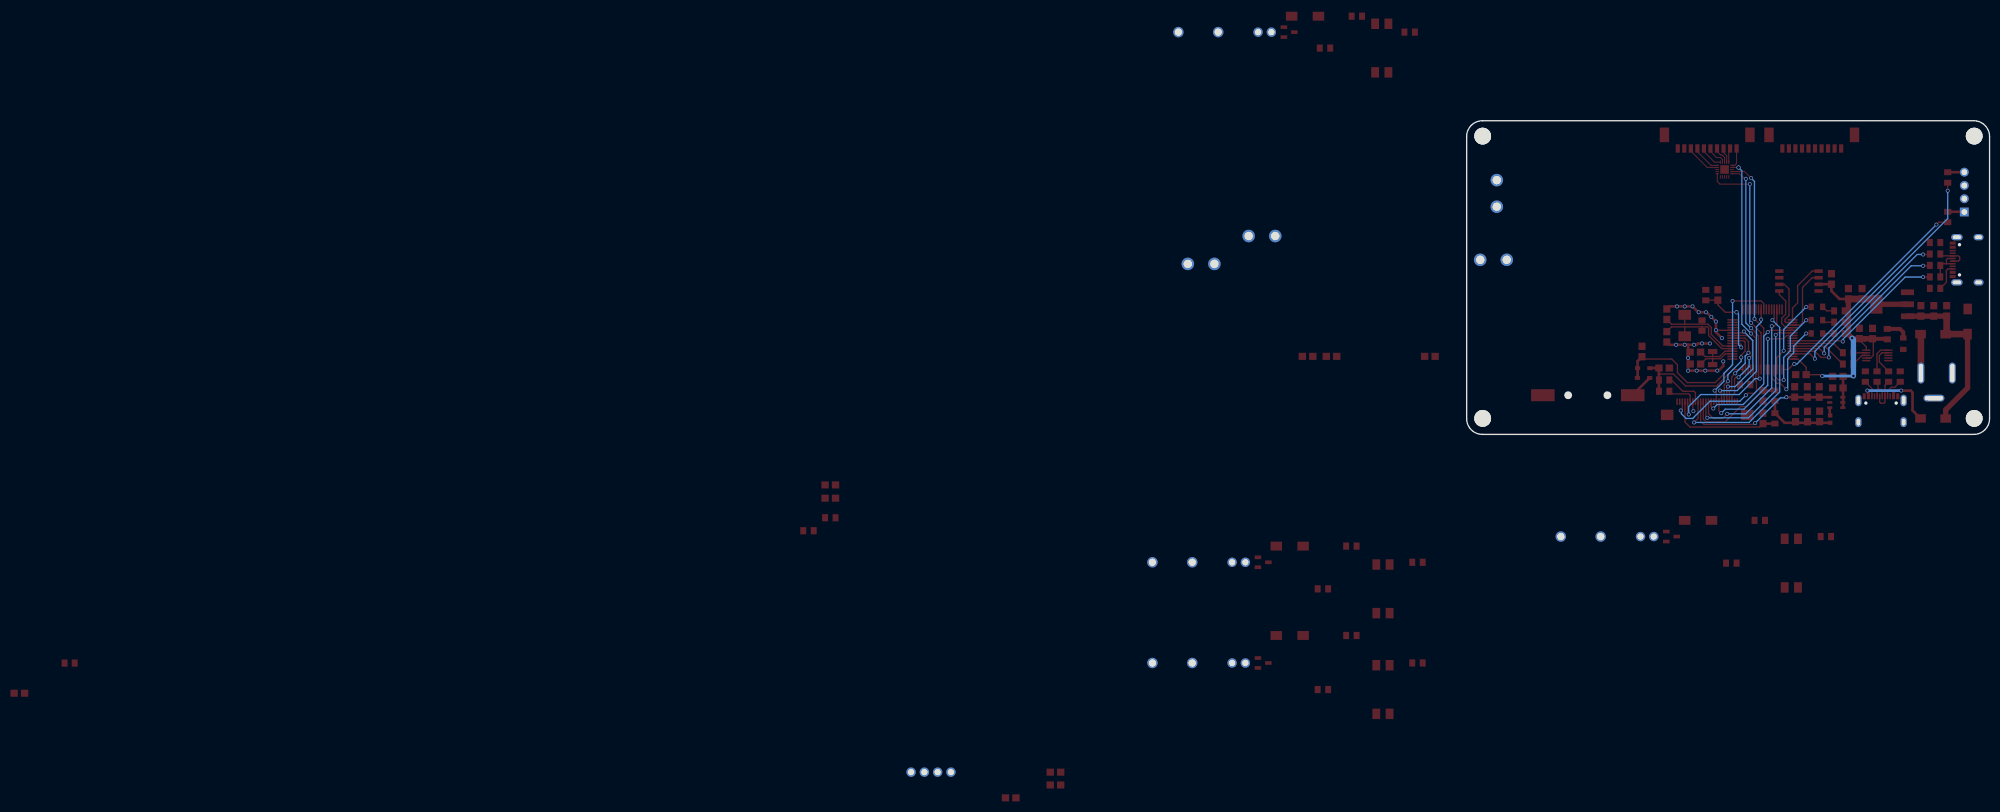
[diagram p4: board, bottom side, seen from below]

Outline 100 x 60 mm; copper layers: Top Layer, Bottom Layer. Coordinates in mm from the lower left corner of the outline.
Outline path: 0,57 arc(0.88,59.12) 3,60 97,60 arc(99.12,59.12) 100,57 100,3 arc(99.12,0.88) 97,0 3,0 arc(0.88,0.88) 0,3 0,57
Stack: Top Layer 0.035mm / Dielectric1 1.51mm FR4 er 4.5 / Bottom Layer 0.035mm

## Design rules (mm)
net USB_DN1: DP2
net USB_DP1: DP2
net USB_DP2: DP1
net USB_DN2: DP1
net M_HX1: DP3
net M_HX2: DP3
net M_LX2: DP4
net M_LX1: DP4
template: 自定义配置
spacing copperThickness1oz (default): track to track 0.178, other pairs 0.152 to 0.3
spacing copperThickness2oz: track to track 0.203, other pairs 0.152 to 0.3
track width copperThickness1oz (default): min 0.203, default 0.254, max 2.54
track width copperThickness2oz: min 0.203, default 0.254, max 2.54
differential pair differentialPair (default): width min 0.127, default 0.254, max 2.54; gap min 0.152, default 0.152
via viaSize (default): diameter min 0.635, default 0.762, max 10; hole min 0.381, default 0.508, max 6.299

## Placement (name value [footprint] x y rotation side)
C1  10uF  [C0805]  8.21 23.62 270 top
C3  10uF  [C0805]  10.67 23.62 270 top
C4  100nF  [C0805]  13.13 23.62 270 top
C6  100nF  [C0805]  27 26.9 270 top
C11  10uF  [C0805]  24.38 26.9 270 top
C16  0.1u  [C0805]  376.79 -49.52 0 top
C24  4.7uF  [C0805]  178.64 -67.07 0 top
C25  4.7uF  [C0805]  178.64 -64.61 0 top
C26  10uF  [C0805]  187.2 -69.53 0 top
C28  100nF  [C0805]  51.95 26.68 90 top
C29  100nF  [C0805]  36.07 11.43 0 top
C30  100nF  [C0805]  62.23 12.7 180 top
C31  100nF  [C0805]  125.84 14.93 0 top
C32  100nF  [C0805]  130.42 14.93 0 top
C33  20p  [C0805]  61.72 18.67 90 top
C34  20p  [C0805]  61.72 22.99 270 top
C35  100nF  [C0805]  30.24 29.73 270 top
C36  20p  [C0805]  56.25 13.46 180 top
C37  20p  [C0805]  56.26 15.75 180 top
C38  100nF  [C0805]  107.03 14.93 0 top
C39  10uF  [C0805]  221.7 -9.66 0 top
C40  100nF  [C0805]  221.7 -12.21 0 top
C43  100nF  [C0805]  66.47 15.85 90 top
C45  10uF  [C0805]  29.01 8.89 180 top
C46  10uF  [C0805]  29.01 11.1 180 top
C47  10uF  [C0805]  32.5 3.44 270 top
C48  10uF  [C0805]  34.81 3.41 270 top
C49  10uF  [C0805]  32.57 8.12 90 top
C50  10uF  [C0805]  34.85 8.12 90 top
C51  100nF  [C0805]  37.27 8.12 90 top
C52  100nF  [C0805]  37.1 3.41 270 top
C53  100nF  [C0805]  24.89 19.3 90 top
C54  100nF  [C0805]  22.38 19.29 270 top
C55  10u  [C0805]  43.33 7.4 90 top
C56  10u  [C0805]  43.33 3.06 90 top
CN1  KF128L-5.08-2P 蓝色  [TH_KF128L-5.08-2P]  94.23 46.1 90 top
CN2  KF128L-5.08-2P 蓝色  [TH_KF128L-5.08-2P]  94.87 33.4 0 top
CN3  KF128L-5.08-2P 蓝色  [TH_KF128L-5.08-2P]  139.15 37.95 0 top
CN4  KF128L-5.08-2P 蓝色  [TH_KF128L-5.08-2P]  150.78 32.62 0 top
CN5  KH-A1251WF-10A  [CONN_SMD_10P-P1.25_KINGHELM_KH-A1251WF-10A]  54 56 180 top
CN10  CR1220_B  [BAT-SMD_CR1220-2ZX]  76.84 7.49 0 top
CN11  KH-A1251WF-10A  [CONN_SMD_10P-P1.25_KINGHELM_KH-A1251WF-10A]  34 56 180 top
D1  SS14  [SMA_L4.2-W2.6-LS5.3-RD]  130.91 80 0 top
D2  SS14  [SMA_L4.2-W2.6-LS5.3-RD]  133.84 -21.37 0 top
D3  SS14  [SMA_L4.2-W2.6-LS5.3-RD]  133.84 -38.47 0 top
D4  SS14  [SMA_L4.2-W2.6-LS5.3-RD]  55.74 -16.45 0 top
D5  1N4148WS  [SOD-323_L1.8-W1.3-LS2.5-RD]  66.14 12.67 180 top
D6  1N4148WS  [SOD-323_L1.8-W1.3-LS2.5-RD]  66.17 10.79 180 top
D7  SS34  [SMA_L4.3-W2.6-LS5.0-RD]  10.8 19.18 0 top
D8  SS34  [SMA_L4.3-W2.6-LS5.0-RD]  10.8 3.05 0 top
D9  SS34  [SMA_L4.3-W2.6-LS5.0-RD]  4.19 21.59 90 top
DC1  -  [DC-2.0]  10 12 180 top
FPC1  F-FPC0M24P-C310  [FPC-SMD_P0.50-24P_XJ-FGS]  54 5 180 top
H2  2.54-1*4P母  [HDR-TH_4P-P2.54-V-F]  4.83 46.36 90 top
K1  HF49FD/012-1H12  [RELAY-TH_HF49FD-XXX-1H12-XXX]  146.24 76.95 0 top
K2  HF49FD/012-1H12  [RELAY-TH_HF49FD-XXX-1H12-XXX]  151.21 -24.47 0 top
K3  HF49FD/012-1H12  [RELAY-TH_HF49FD-XXX-1H12-XXX]  151.21 -43.73 0 top
K4  HF49FD/012-1H12  [RELAY-TH_HF49FD-XXX-1H12-XXX]  73.1 -19.54 0 top
L4  10uH  [L0805]  367.17 -43.75 0 top
L6  BLM18AG601SN1D  [L0603]  30.48 2.92 270 top
LED2  -  [LED_0805]  32.96 24.4 180 top
LED3  -  [LED_0805]  32.96 21.86 180 top
LED4  -  [LED_0805]  32.96 19.31 180 top
LED5  -  [LED_0805]  16.51 17.4 90 top
Q1  SS8050  [SOT-23-3_L2.9-W1.3-P1.90-LS2.4-BR]  133.95 76.95 0 top
Q2  SS8050  [SOT-23-3_L2.9-W1.3-P1.90-LS2.4-BR]  138.92 -24.47 0 top
Q3  SS8050  [SOT-23-3_L2.9-W1.3-P1.90-LS2.4-BR]  138.92 -43.73 0 top
Q4  SS8050  [SOT-23-3_L2.9-W1.3-P1.90-LS2.4-BR]  60.82 -19.54 0 top
R1  5.1K  [R0805]  10.41 27.94 0 top
R2  5.1K  [R0805]  10.41 36.7 0 top
R3  22R  [R0805]  10.41 34.51 0 top
R4  22R  [R0805]  10.41 32.32 0 top
R9  10kΩ  [R0805]  110.9 76.95 0 top
R10  10kΩ  [R0805]  121 80 0 top
R11  10kΩ  [R0805]  127.1 73.91 0 top
R12  10kΩ  [R0805]  109.41 -24.47 0 top
R13  10kΩ  [R0805]  122.05 -21.37 0 top
R14  10kΩ  [R0805]  127.49 -29.55 0 top
R15  10kΩ  [R0805]  109.41 -43.73 0 top
R16  10kΩ  [R0805]  122.05 -38.47 0 top
R17  10kΩ  [R0805]  127.49 -48.81 0 top
R18  10kΩ  [R0805]  31.3 -19.54 0 top
R19  10kΩ  [R0805]  43.94 -16.45 0 top
R20  10kΩ  [R0805]  49.39 -24.62 0 top
R21  10K  [R0805]  46.74 9.53 180 top
R22  10K  [R0805]  54.27 26.65 90 top
R27  1M  [R0805]  54.99 20.83 90 top
R28  10kΩ  [R0805]  225.87 -18.44 0 top
R29  10kΩ  [R0805]  221.7 -15.95 0 top
R38  100R  [R0805]  8 41.59 270 top
R39  100R  [R0805]  8 49.15 270 top
R44  10K  [R0805]  62.23 8.25 0 top
R45  10K  [R0805]  62.23 10.41 0 top
R46  300R  [R0805]  28.7 19.3 0 top
R47  300R  [R0805]  28.72 21.47 0 top
R48  300R  [R0805]  28.72 23.63 0 top
R49  510R  [R0805]  19.56 19.18 270 top
R50  5.1K  [R0805]  23.75 11.06 90 top
R51  5.1K  [R0805]  17.08 11.06 90 top
R52  22R  [R0805]  21.53 11.06 90 top
R53  22R  [R0805]  19.3 11.06 90 top
R54  1.5K  [R0805]  10.41 30.13 0 top
R55  300R  [R0805]  27.06 13.46 0 top
R56  300R  [R0805]  27.06 15.63 0 top
R57  0R  [R0805]  41.04 7.39 270 top
R58  0R  [R0805]  41.04 3.07 90 top
TP1  -  [M3螺丝]  3 3 0 top
TP2  -  [M3螺丝]  97 3 0 top
TP3  -  [M3螺丝]  97 57 0 top
TP4  -  [M3螺丝]  3 57 0 top
U3  TLP521-1XSM  [SMD-4_L4.6-W6.5-P2.54-LS10.2-BL]  116.24 73.91 0 top
U4  B0505S-1WR3  [PWRM-TH_B0503S-1WR3]  202.44 -64.61 0 top
U5  TLP521-1XSM  [SMD-4_L4.6-W6.5-P2.54-LS10.2-BL]  116.01 -29.55 0 top
U6  TLP521-1XSM  [SMD-4_L4.6-W6.5-P2.54-LS10.2-BL]  116.01 -48.81 0 top
U7  TLP521-1XSM  [SMD-4_L4.6-W6.5-P2.54-LS10.2-BL]  37.91 -24.62 0 top
U12  8M-5032-2P  [CRYSTAL-SMD_L5.0-W3.2]  58.29 20.83 270 top
U13  GD25Q16CSAG-SOP8_208MIL  [SOP-8_L5.2-W5.3-P1.27-LS7.9-BL]  36.45 29.34 270 top
U14  MDC04  [QFN-20_L3.0-W3.0-P0.40-BL-EP1.7]  50.67 50.67 90 top
U17  GD32F103RCT6  [LQFP-64_L10.0-W10.0-P0.50-LS12.0-BL]  43.43 18.16 90 top
U19  -  [SOT_DPV]  28.07 7.11 0 top
U20  CH340E  [MSOP-10_L3.0-W3.0-P0.50-LS5.0-BL]  21.46 15.11 270 top
U21  AMS1117-3.3  [SOT-223-3_L6.5-W3.4-P2.30-LS7.0-BR]  18.67 24.89 180 top
USB1  CQ-USB- TYPE-C 16P母座四脚插板有柱  [USB-C-SMD_CQ-USB-TYPE-C]  4.57 33.4 270 top
USB2  CQ-USB- TYPE-C 16P母座四脚插板有柱  [USB-C-SMD_CQ-USB-TYPE-C]  20.76 4.82 0 top
X1  32.768kHz  [FC-135R_L3.2-W1.5]  52.96 14.61 270 top

## Footprints (pads in the part's own frame, mm; a bottom-side part is the same pattern mirrored in y, then rotated)
BAT-SMD_CR1220-2ZX
  rect 4.5x2.3 smd: 1(-8.6,0) 2(8.6,0)
C0805
  rect 1.41x1.35 smd: 1(-1,0) 2(1,0)
CONN_SMD_10P-P1.25_KINGHELM_KH-A1251WF-10A
  rect 0.8x1.6 smd: 1(-5.625,1.3) 2(-4.375,1.3) 3(-3.125,1.3) 4(-1.875,1.3) 5(-0.625,1.3) 6(0.625,1.3) 7(1.875,1.3) 8(3.124,1.3) 9(4.375,1.3) 10(5.625,1.3)
  rect 1.8x2.8 smd: 11(8.175,-1.3) 12(-8.175,-1.3)
CRYSTAL-SMD_L5.0-W3.2
  rect 1.9x2.4 smd: 1(-2.05,0) 2(2.05,0)
DC-2.0
  oval 4x1.3 hole 3.5x0.8: 2(-0.627,5.067)
  oval 1.3x4 hole 0.8x3.5: 3(2.873,0.267) 4(-3.127,0.267)
FC-135R_L3.2-W1.5
  rect 1x1.8 smd: 1(-1.25,0) 2(1.25,0)
FPC-SMD_P0.50-24P_XJ-FGS
  rect 0.3x1.25 smd: 1(-5.752,-1.262) 2(-5.25,-1.262) 3(-4.75,-1.262) 4(-4.25,-1.262) 5(-3.75,-1.262) 6(-3.25,-1.262) 7(-2.75,-1.262) 8(-2.25,-1.262) 9(-1.75,-1.262) 10(-1.25,-1.262) 11(-0.75,-1.262) 12(-0.25,-1.262) 13(0.25,-1.262) 14(0.75,-1.262) 15(1.25,-1.262) 16(1.75,-1.262) 17(2.25,-1.262) 18(2.75,-1.262) 19(3.25,-1.262) 20(3.75,-1.262) 21(4.25,-1.262) 22(4.75,-1.262) 23(5.25,-1.262) 24(5.75,-1.262)
  rect 2.4x2 smd: 25(-7.65,1.262) 26(7.65,1.262)
HDR-TH_4P-P2.54-V-F
  rect 1.7x1.7 hole 1.1: 1(-3.81,0)
  round 1.7 hole 1.1: 2(-1.27,0) 3(1.27,0) 4(3.81,0)
L0603
  rect 0.8x0.864 smd: 1(-0.7,0) 2(0.7,0)
L0805
  rect 1.133x1.377 smd: 1(-0.966,0) 2(0.966,0)
LED_0805
  rect 1x1.25 smd: 1(-1.15,0.005) 2(1.05,0.005)
LQFP-64_L10.0-W10.0-P0.50-LS12.0-BL
  oval 0.3x2 smd: 1(-3.75,-5.75) 2(-3.25,-5.75) 3(-2.75,-5.75) 4(-2.25,-5.75) 5(-1.75,-5.75) 6(-1.25,-5.75) 7(-0.75,-5.75) 8(-0.25,-5.75) 9(0.25,-5.75) 10(0.75,-5.75) 11(1.25,-5.75) 12(1.75,-5.75) 13(2.25,-5.75) 14(2.75,-5.75) 15(3.25,-5.75) 16(3.75,-5.75) 33(3.75,5.75) 34(3.25,5.75) 35(2.75,5.75) 36(2.25,5.75) 37(1.75,5.75) 38(1.25,5.75) 39(0.75,5.75) 40(0.25,5.75) 41(-0.25,5.75) 42(-0.75,5.75) 43(-1.25,5.75) 44(-1.75,5.75) 45(-2.25,5.75) 46(-2.75,5.75) 47(-3.25,5.75) 48(-3.75,5.75)
  oval 2x0.3 smd: 17(5.75,-3.75) 18(5.75,-3.25) 19(5.75,-2.75) 20(5.75,-2.25) 21(5.75,-1.75) 22(5.75,-1.25) 23(5.75,-0.75) 24(5.75,-0.25) 25(5.75,0.25) 26(5.75,0.75) 27(5.75,1.25) 28(5.75,1.75) 29(5.75,2.25) 30(5.75,2.75) 31(5.75,3.25) 32(5.75,3.75) 49(-5.75,3.75) 50(-5.75,3.25) 51(-5.75,2.75) 52(-5.75,2.25) 53(-5.75,1.75) 54(-5.75,1.25) 55(-5.75,0.75) 56(-5.75,0.25) 57(-5.75,-0.25) 58(-5.75,-0.75) 59(-5.75,-1.25) 60(-5.75,-1.75) 61(-5.75,-2.25) 62(-5.75,-2.75) 63(-5.75,-3.25) 64(-5.75,-3.75)
M3螺丝
  round 3.2 hole 3.2: 1(-0.064,0.064)
MSOP-10_L3.0-W3.0-P0.50-LS5.0-BL
  oval 0.28x1.62 smd: 1(-1,-2.11) 2(-0.5,-2.11) 3(0,-2.11) 4(0.5,-2.11) 5(1,-2.11) 6(1,2.11) 7(0.5,2.11) 8(0,2.11) 9(-0.5,2.11) 10(-1,2.11)
PWRM-TH_B0503S-1WR3
  round 1.8 hole 1.2: 1(-3.81,0) 2(-1.27,0) 3(1.27,0) 4(3.81,0)
QFN-20_L3.0-W3.0-P0.40-BL-EP1.7
  rect 0.2x0.665 smd: 1(-0.8,-1.407) 2(-0.4,-1.407) 3(0,-1.407) 4(0.4,-1.407) 5(0.8,-1.407) 11(0.8,1.407) 12(0.4,1.407) 13(0,1.407) 14(-0.4,1.407) 15(-0.8,1.407)
  rect 0.665x0.2 smd: 6(1.407,-0.8) 7(1.407,-0.4) 8(1.407,0) 9(1.407,0.4) 10(1.407,0.8) 16(-1.407,0.8) 17(-1.407,0.4) 18(-1.407,0) 19(-1.407,-0.4) 20(-1.407,-0.8)
  rect 1.65x1.65 smd: 21(0,0)
R0805
  rect 1.133x1.377 smd: 1(-1,0) 2(1,0)
RELAY-TH_HF49FD-XXX-1H12-XXX
  round 1.8 hole 1.2: 1(-8.89,0) 2(-6.35,0)
  round 2 hole 1.4: 3(1.27,0) 4(8.89,0)
SMA_L4.2-W2.6-LS5.3-RD
  rect 2.2x1.7 smd: 1(-2.566,0) 2(2.566,0)
SMA_L4.3-W2.6-LS5.0-RD
  rect 2.046x1.62 smd: 1(-2.404,-0.009) 2(2.404,0.009)
SMD-4_L4.6-W6.5-P2.54-LS10.2-BL
  rect 1.5x2 smd: 1(-1.27,-4.65) 2(1.27,-4.65) 3(1.27,4.65) 4(-1.27,4.65)
SOD-323_L1.8-W1.3-LS2.5-RD
  rect 1x0.75 smd: 1(-1.173,0) 2(1.173,0)
SOP-8_L5.2-W5.3-P1.27-LS7.9-BL
  rect 0.7x1.6 smd: 1(-1.905,-3.75) 2(-0.635,-3.75) 3(0.635,-3.75) 4(1.905,-3.75) 5(1.905,3.75) 6(0.635,3.75) 7(-0.635,3.75) 8(-1.905,3.75)
SOT-23-3_L2.9-W1.3-P1.90-LS2.4-BR
  rect 1.25x0.7 smd: 1(1,-0.95) 2(1,0.95) 3(-1,0)
SOT-223-3_L6.5-W3.4-P2.30-LS7.0-BR
  rect 2.5x1.1 smd: 1(2.97,-2.3) 2(2.97,0) 3(2.97,2.3)
  rect 2.34x3.6 smd: 4(-2.97,0)
SOT_DPV
  rect 1x0.5 smd: 1(0,0) 2(0,-1) 3(0,-2) 4(2.5,-2) 5(2.5,-1) 6(2.5,0)
TH_KF128L-5.08-2P
  round 2.4 hole 1.6: 1(-2.54,0) 2(2.54,0)
USB-C-SMD_CQ-USB-TYPE-C
  oval 1.2x2.2 hole 0.7x1.6: 0(-4.32,1.675) 0(4.32,1.675)
  oval 1.2x1.9 hole 0.7x1.3: 0(-4.32,-2.475) 0(4.32,-2.475)
  rect 0.6x1.15 smd: A1B12(-3.2,2.471) A4B9(-2.4,2.471) B1A12(3.2,2.475) B4A9(2.4,2.475)
  rect 0.3x1.15 smd: A5(-1.25,2.475) A6(-0.25,2.475) A7(0.25,2.474) A8(1.25,2.475) B5(1.75,2.475) B6(0.75,2.475) B7(-0.75,2.473) B8(-1.75,2.475)

## Nets
As in the schematic.

Pads without a net: CN11 8; FPC1 1 23 24; U14 16 17 18 19; U17 2 40 50 54 55 61 62; U20 4 5 6; USB1 A8 B8; USB2 A8 B8

## Via types
v1: diameter 0.762, hole 0.508, Top Layer to Bottom Layer, 82 vias

## Routing (per net, layer and track width the routed paths; a pad name or vN(x,y) marks a point on that pad's centre or on a via; arc(x,y) is an arc through that point)
+1V5: length 30.8
  Top Layer w0.254: v1(44.83,2.16) 45.09,1.91 54.61,1.91 55.25,2.54 FPC1.10
  Top Layer w0.508: U19.6 37.26,7.11 C51.1 37.28,7.11 v1(38.86,7.11)
  Bottom Layer w0.254: v1(44.83,2.16) 40,6.99 38.99,6.99 v1(38.86,7.11)
+2V8: length 13.6
  Top Layer w0.508: L6.2 39.19,2.22 R58.2 R57.2
GND: length 39.1
  Top Layer w0.254: v1(52.32,19.94) 52.3,19.91 U17.12
  Top Layer w0.508: 57.67,17.14 v1(58.29,17.14) v1(59.94,17.14) 61.2,17.14 C33.1 ; 57.67,17.14 57.66,17.13 v1(57.66,14.61) v1(57.66,12.19) v1(56.01,12.19) v1(54.36,12.19) v1(52.07,12.19) 51.82,12.19 50.93,13.08 v1(50.93,13.97) ; 57.67,17.14 v1(56.51,17.14) 56.01,17.14 55.75,17.4 v1(54.99,17.4) v1(53.47,17.4) ; v1(51.18,18.42) 52.32,19.56 v1(52.32,19.94) v1(52.32,21.59) v1(53.21,22.48) 54.1,23.37 v1(55.63,23.37) 55.69,23.37 v1(56.81,24.48) v1(58.29,24.48) v1(59.78,24.48) 61.23,24.48 C34.1
  vias: v1(54.23,23.37)
VDD: length 95.3
  Top Layer w0.254: C54.2 22.22,18.14 22.22,15.11 22.72,14.61 U20.7 ; U17.48 36.64,14.41 35.07,12.84 C29.1 32.26,11.43 v1(32,11.18) ; U20.10 23.57,16.76 24.89,18.08 C53.1 ; U17.64 49.06,12.41 52.2,9.27 58.17,9.27 60.45,11.56 63.18,11.56 63.23,11.6
  Top Layer w0.508: v1(26.03,11.18) 26.11,11.1 C46.2 ; C46.2 C45.2 28.01,5.17 U19.3 ; C46.2 27.94,11.18 ; C6.2 27,25.91 28.7,25.91 30.24,27.45 C35.2 32.67,28.73 U13.3 ; D5.2 64.94,12.7 C30.1 R45.2 R44.2
  Top Layer w0.762: C54.2 19.67,18.29 R49.2
  Top Layer w1.016: U21.2 U21.4 ; C53.1 26.18,18.3 v1(26.29,18.42) 27,19.12 C6.2 ; 24.89,18.29 23.89,18.29 23.88,18.3 23.86,18.29 C54.2
  Top Layer w1.27: C6.2 C11.2 22.65,25.9 U21.4
  Bottom Layer w0.508: v1(32,11.18) v1(26.03,11.18)
  Bottom Layer w1.016: v1(26.03,11.18) 26.03,18.16 v1(26.29,18.42)
C_CLK: length 32.9
  Top Layer w0.254: U17.30 40.68,21.21 41.19,20.7 v1(41.66,20.7) ; FPC1.13 53.75,3.97 52.83,3.05 51.05,3.05 v1(50.16,3.94)
  Bottom Layer w0.254: v1(50.16,3.94) 46.61,3.94 41.66,8.89 v1(41.66,20.7)
C_HSYNC: length 39.6
  Top Layer w0.254: v1(41.53,21.84) 41.18,22.19 U17.29 ; v1(56.51,2.29) 55.75,3.05 FPC1.9
  Bottom Layer w0.254: v1(41.53,21.84) 40.13,20.45 40.13,8.13 45.97,2.29 v1(56.51,2.29)
C_PCLK: length 27.4
  Top Layer w0.254: U17.39 38.81,18.91 39.43,18.29 v1(42.42,18.29) ; FPC1.17 51.75,4.51 v1(51.31,4.06)
  Bottom Layer w0.254: v1(42.42,18.29) 42.42,9.4 46.99,4.83 50.55,4.83 v1(51.31,4.06)
C_PWDN: length 7.7
  Top Layer w0.254: R45.1 60.83,10.41 58.67,8.25 56.51,8.25 56.25,7.99 FPC1.8
C_RST: length 5.5
  Top Layer w0.254: R44.1 60.72,7.75 57.53,7.75 57.25,7.47 FPC1.6
C_VSYNC: length 1.9
  Top Layer w0.254: v1(56.64,4.44) 56.75,4.55 FPC1.7
CAMV: length 1.5
  Top Layer w0.508: U19.4 30.57,3.71 L6.1
CIN_1: length 4.6
  Top Layer w0.203: CN5.5 54.62,54.12 52.59,52.08 U14.6
CIN_2: length 3.4
  Top Layer w0.203: U14.8 50.67,52.96 51.19,53.48 51.45,53.48 52.07,54.1 52.07,54.64 CN5.7
CIN_3: length 2.7
  Top Layer w0.203: CN5.9 49.87,54.45 U14.10
CIN_4: length 5.5
  Top Layer w0.203: U14.5 53.25,51.47 55.88,54.1 CN5.4
COUT_1: length 4
  Top Layer w0.203: CN5.6 53.38,54.14 52.2,52.96 51.47,52.96 51.07,52.57 U14.7
COUT_2: length 2.9
  Top Layer w0.203: CN5.8 50.88,53.92 50.27,53.32 U14.9
COUT_3: length 3.9
  Top Layer w0.203: U14.11 48.73,51.47 48.39,51.82 48.39,54.69 CN5.10
COUT_4: length 6.8
  Top Layer w0.203: CN5.3 57.12,54.2 53.99,51.07 52.08,51.07
CS: length 12.1
  Top Layer w0.254: U17.33 37.68,24.17 36.7,25.15 36.7,28.45 33.91,31.24 U13.1
D_DATA0: length 15.6
  Top Layer w0.254: v1(47.5,14.73) 47.5,15.18 46.74,15.94 46.74,17.65 46.99,17.91 U17.8 ; FPC1.19 50.75,9.45 v1(50.04,10.16)
  Bottom Layer w0.254: v1(50.04,10.16) 50.04,11.43 47.5,13.97 v1(47.5,14.73)
D_DATA1: length 16.4
  Top Layer w0.254: v1(48.64,11.68) 49.33,11 49.33,8.71 49.75,8.29 FPC1.21 ; v1(46.1,15.62) 46.1,17.78 46.73,18.41 U17.9
  Bottom Layer w0.254: v1(48.64,11.68) 46.74,13.59 46.74,14.99 v1(46.1,15.62)
D_DATA2: length 17.8
  Top Layer w0.254: v1(45.97,14.61) 45.34,15.24 45.34,17.91 46.34,18.91 U17.10 ; v1(48.01,10.92) 48.51,10.92 48.77,10.67 48.77,7.87 49.25,7.39 FPC1.22
  Bottom Layer w0.254: v1(45.97,14.61) 45.97,12.95 v1(48.01,10.92)
D_DATA3: length 19.3
  Top Layer w0.254: FPC1.20 50.25,8.93 v1(50.04,9.14) ; v1(46.99,19.69) 47.26,19.41 U17.11
  Bottom Layer w0.254: v1(50.04,9.14) 48.64,9.14 45.26,12.52 45.26,17.96 v1(46.99,19.69)
D_DATA4: length 23
  Top Layer w0.254: v1(43.69,21.97) 43.68,21.97 U17.24 ; v1(51.56,8.38) 51.25,8.07 FPC1.18
  Bottom Layer w0.254: v1(43.69,21.97) 43.69,21.46 44.58,20.57 44.58,12.06 48.26,8.38 v1(51.56,8.38)
D_DATA5: length 28.1
  Top Layer w0.254: v1(49.15,25.53) 43.69,25.53 43.18,25.02 U17.25 ; v1(52.58,8.38) 52.25,8.05 FPC1.16
  Bottom Layer w0.254: v1(49.15,25.53) 49.15,13.33 50.8,11.68 50.8,10.16 v1(52.58,8.38)
D_DATA6: length 28.2
  Top Layer w0.254: U17.37 42.06,19.91 v1(42.42,19.56) ; FPC1.14 53.25,5.37 v1(52.83,4.95)
  Bottom Layer w0.254: v1(42.42,19.56) 43.18,18.8 43.18,9.65 47.12,5.72 52.07,5.72 v1(52.83,4.95)
D_DATA7: length 32.5
  Top Layer w0.254: v1(40.89,19.05) 40.53,19.41 U17.38 ; v1(53.97,3.18) 54.25,3.45 FPC1.12
  Bottom Layer w0.254: v1(53.97,3.18) 46.1,3.18 40.89,8.38 v1(40.89,19.05)
DC: length 33.1
  Top Layer w1.016: C1.2 C3.2 C4.2 15.67,22.62 U21.3 ; D8.1 8.39,4.69 4.2,8.88 D9.1
  Top Layer w1.27: 8.37,19.19 8.21,19.35 C1.2 ; 8.37,19.19 D9.1 ; 8.37,19.19 D7.1
M_ALERT: length 41.8
  Top Layer w0.203: v1(45.59,49.02) 46.84,50.27 U14.14
  Top Layer w0.254: U17.56 43.18,20.32 v1(44.96,22.1)
  Bottom Layer w0.254: v1(44.96,22.1) 44.96,48.39 v1(45.59,49.02)
M_C: length 48.9
  Top Layer w0.254: v1(8,46.61) R39.2 ; U17.46 34.33,15.41 v1(33.4,14.48)
  Bottom Layer w0.254: v1(33.4,14.48) 33.4,15.89 8,41.28 v1(8,46.61)
M_HX1: length 18
  Top Layer w0.254: 54.99,20.57 58.3,20.57 ; 54.99,20.57 54.99,20.57 R27.1 ; 54.99,20.57 53.97,20.57 53.72,20.32 53.72,18.92 51.21,16.41 U17.5 ; 58.3,20.57 58.29,20.57 U12.2 ; 58.3,20.57 60.82,20.57 C33.2
M_HX2: length 18
  Top Layer w0.254: 55,21.08 55,21.82 R27.2 ; 55,21.08 58.29,21.08 ; 55,21.08 53.85,21.08 53.21,20.45 53.21,19.12 51,16.91 U17.6 ; 58.29,21.08 58.29,21.09 U12.1 ; 58.29,21.08 60.82,21.08 C34.2
M_LX1: length 8
  Top Layer w0.254: X1.2 52.96,14.47 52.95,14.48 ; 52.95,14.48 54.23,14.48 C36.2 ; 52.95,14.48 51.46,14.48 50.53,15.41 U17.3
M_LX2: length 7.8
  Top Layer w0.254: 52.95,14.88 52.96,14.89 X1.1 ; 52.95,14.88 51.63,14.88 50.61,15.91 U17.4 ; 52.95,14.88 54.4,14.88 C37.2
M_RST#: length 16.8
  Top Layer w0.254: v1(47.5,16.64) 47.5,17.14 47.76,17.41 U17.7 ; v1(48.39,23.37) 50.55,23.37 51.94,24.77 51.94,25.67 C28.1 54.24,25.68 R22.1
  Bottom Layer w0.254: v1(47.5,16.64) 48.01,17.14 48.01,22.99 v1(48.39,23.37)
M_SCL: length 62.3
  Top Layer w0.203: U14.15 47.85,49.87 46.87,48.89 v1(46.61,48.89)
  Top Layer w0.254: v1(57.53,3.81) 57.75,4.03 FPC1.5 ; v1(43.94,10.67) 44.18,10.91 U17.58 44.18,18.91 v1(45.59,20.32)
  Bottom Layer w0.254: v1(43.94,10.67) 44.83,10.67 47.88,7.62 55.25,7.62 57.53,5.33 v1(57.53,3.81) ; v1(45.59,20.32) 46.61,21.34 v1(46.61,48.89)
M_SDA: length 64.9
  Top Layer w0.203: 49.27,51.07 48.03,51.07 v1(48.01,51.05)
  Top Layer w0.254: v1(45.59,19.3) 44.68,18.39 U17.59 44.68,10.14 44.58,10.03 44.58,8.25 44.96,7.87 46.23,7.87 v1(46.61,7.49) ; v1(59.06,4.57) 58.75,4.88 FPC1.3
  Bottom Layer w0.254: v1(45.59,19.3) 47.37,21.08 47.37,50.42 v1(48.01,51.05) ; v1(46.61,7.49) 47.75,6.35 53.47,6.35 56.77,3.05 58.04,3.05 58.93,3.94 58.93,4.44 v1(59.06,4.57)
MISO: length 12.7
  Top Layer w0.254: U17.35 36.24,20.91 35.76,21.39 35.76,28.12 33.91,29.97 U13.2
MOSI: length 9.4
  Top Layer w0.254: U17.36 38.95,20.41 39.75,21.21 39.75,22.22 38.99,22.99 38.99,25.53 40.2,26.74 U13.5
S_RESET#: length 44.3
  Top Layer w0.203: U14.1 52.07,49.86 52.07,48.39 51.56,47.88 v1(45.85,47.88)
  Top Layer w0.254: v1(45.59,21.34) 43.68,19.43 U17.57
  Bottom Layer w0.254: v1(45.59,21.34) 45.85,21.59 v1(45.85,47.88)
SCK: length 10.3
  Top Layer w0.254: U17.34 38.94,21.41 39.12,21.59 39.12,22.01 38.35,22.78 38.35,27.81 39.24,28.7 U13.6
USART_RXD: length 11.1
  Top Layer w0.254: U17.43 37.66,16.89 31.49,16.89 R55.2
USART_TXD: length 10.4
  Top Layer w0.254: U17.42 37.67,17.4 29.83,17.4 R56.2
USB_CTRL: length 31.7
  Top Layer w0.254: v1(12.7,30.1) 11.45,30.1 R54.2 ; v1(28.07,17.78) 28.2,17.91 U17.41
  Bottom Layer w0.254: v1(12.7,30.1) 16.13,30.1 28.07,18.16 v1(28.07,17.78)
USB_DN1: length 35.2
  Top Layer w0.254: v1(12.7,34.42) 11.51,34.42 R3.2 ; v1(31.62,15.49) 32.54,16.41 U17.44
  Bottom Layer w0.254: v1(31.62,15.49) 31.62,16.64 13.84,34.42 v1(12.7,34.42)
USB_DN2: length 5.7
  Top Layer w0.254: U20.2 20.57,15.61 21.08,15.11 21.08,13.84 R53.2
USB_DP1: length 35.1
  Top Layer w0.254: v1(12.7,32.26) 11.48,32.26 R4.2 ; U17.45 33.44,15.91 32.26,14.73 v1(30.73,14.73)
  Bottom Layer w0.254: v1(30.73,14.73) 30.73,16.51 14.99,32.26 v1(12.7,32.26)
USB_DP2: length 5.8
  Top Layer w0.254: U20.1 20.84,16.11 21.53,15.43 R52.2
$1N757: length 5.2
  Top Layer w0.254: USB1.B5 7.97,31.65 8.25,31.37 8.25,29.1 R1.1
$1N986: length 5.9
  Top Layer w0.254: R3.1 9.05,34.15 USB1.B7 5.96,34.15 5.72,33.91 5.72,33.4 5.97,33.15 7.04,33.15 USB1.A7
$1N5837: length 4.4
  Top Layer w0.762: 16.5,18.45 16.5,19.55 17.13,20.18 R49.1
$1N6125: length 4.2
  Top Layer w0.254: USB2.A5 19.51,8.31 18.8,9.02 18.12,9.02 R51.1
$1N6128: length 3.3
  Top Layer w0.254: R50.1 23.75,10.03 22.51,8.79 USB2.B5
$1N6129: length 17.9
  Top Layer w0.508: USB2.A4B9 18.36,8.06 18.03,8.38 v1(16.89,8.38) 15.11,8.38 14.73,8 14.73,4.59 D8.2 ; USB2.B4A9 23.16,8.17 v1(23.37,8.38)
  Bottom Layer w0.508: v1(23.37,8.38) v1(16.89,8.38)
$1N6270: length 5
  Top Layer w0.254: USB2.B6 21.51,8.47 21.34,8.64 ; 21.34,8.64 20.7,8.64 20.51,8.44 USB2.A6 ; 21.34,8.64 21.34,9.87 R52.1
$1N6277: length 6.5
  Top Layer w0.254: R53.1 20.01,9.35 USB2.B7 20.01,6.16 20.19,5.97 20.83,5.97 21.01,6.15 USB2.A7
$1N6306: length 6.8
  Top Layer w0.254: 8.28,32.65 8.25,32.68 8.25,33.4 8,33.65 USB1.A6 ; 8.28,32.65 USB1.B6 ; 8.28,32.65 9.08,32.65 R4.1 R54.1
$1N6538: length 3.2
  Top Layer w0.254: R55.1 24.4,15.11 U20.8
$1N6566: length 2.5
  Top Layer w0.254: R56.1 26.05,15.61 U20.9
$1N7582: length 7.5
  Top Layer w1.27: D7.2 13.13,19.11 DC1.4
$3N3779: length 4.6
  Top Layer w0.508: D6.2 68.24,7.55 CN10.1
$3N4170: length 3.2
  Top Layer w0.508: H2.1 4.87,42.59 R38.1
$3N4171: length 3.2
  Top Layer w0.508: H2.4 7.98,50.17 R39.1
$3N4361: length 3.1
  Top Layer w0.254: R21.2 45.18,10.08 U17.60
$3N4426: length 27.2
  Top Layer w0.254: C43.1 66.03,14.41 60.77,14.41 59.69,13.33 59.69,11.81 57.78,9.91 52.45,9.91 49.18,13.17 U17.1
  Top Layer w0.508: C43.1 67.31,14.01 D5.1 67.31,10.82 D6.1
$3N5935: length 43.4
  Top Layer w0.254: R38.2 9.7,40.59 v1(10.16,40.13) ; U17.49 38.52,12.41 37.47,13.46 v1(37.34,13.46)
  Bottom Layer w0.254: v1(37.34,13.46) 36.83,13.46 v1(10.16,40.13)
$3N8528: length 15.3
  Top Layer w0.254: U17.51 40.68,14.69 v1(39.37,16) ; LED2.1 34.12,24.38 v1(35.05,24.38)
  Bottom Layer w0.254: v1(39.37,16) 39.37,20.07 v1(35.05,24.38)
$3N8530: length 17.5
  Top Layer w0.254: v1(35.05,21.84) 35.04,21.85 LED3.1 ; U17.52 41.18,11.21 40.39,10.41 v1(39.37,10.41)
  Bottom Layer w0.254: v1(39.37,10.41) 39.37,14.73 38.1,16 38.1,18.8 v1(35.05,21.84)
$3N8532: length 18.5
  Top Layer w0.254: v1(35.05,19.3) 34.11,19.3 LED4.1 ; v1(38.86,8.64) 40,9.78 40.64,9.78 41.68,10.82 U17.53
  Bottom Layer w0.254: v1(38.86,8.64) 38.61,8.89 38.61,14.48 37.47,15.62 37.47,16.89 v1(35.05,19.3)
$3N8599: length 2.2
  Top Layer w0.254: R46.2 31.9,19.3 LED4.2
$3N8602: length 2.3
  Top Layer w0.254: R47.2 31.53,21.47 LED3.2
$3N8605: length 2.5
  Top Layer w0.254: R48.2 31.14,23.63 LED2.2
$3N13768: length 19.7
  Top Layer w0.254: C55.2 46.4,5.33 47.62,5.33 50.55,2.41 54.23,2.41 54.75,2.93 FPC1.11
  Top Layer w0.508: C55.2 43.32,8.39 R57.1
$3N13829: length 21.8
  Top Layer w0.254: C56.1 44,1.4 57.28,1.4 58.25,2.37 FPC1.4
  Top Layer w0.508: C56.1 41.06,2.06 R58.1
